# EasyEDA Pro project TeenyV4.eprj, board PCB1
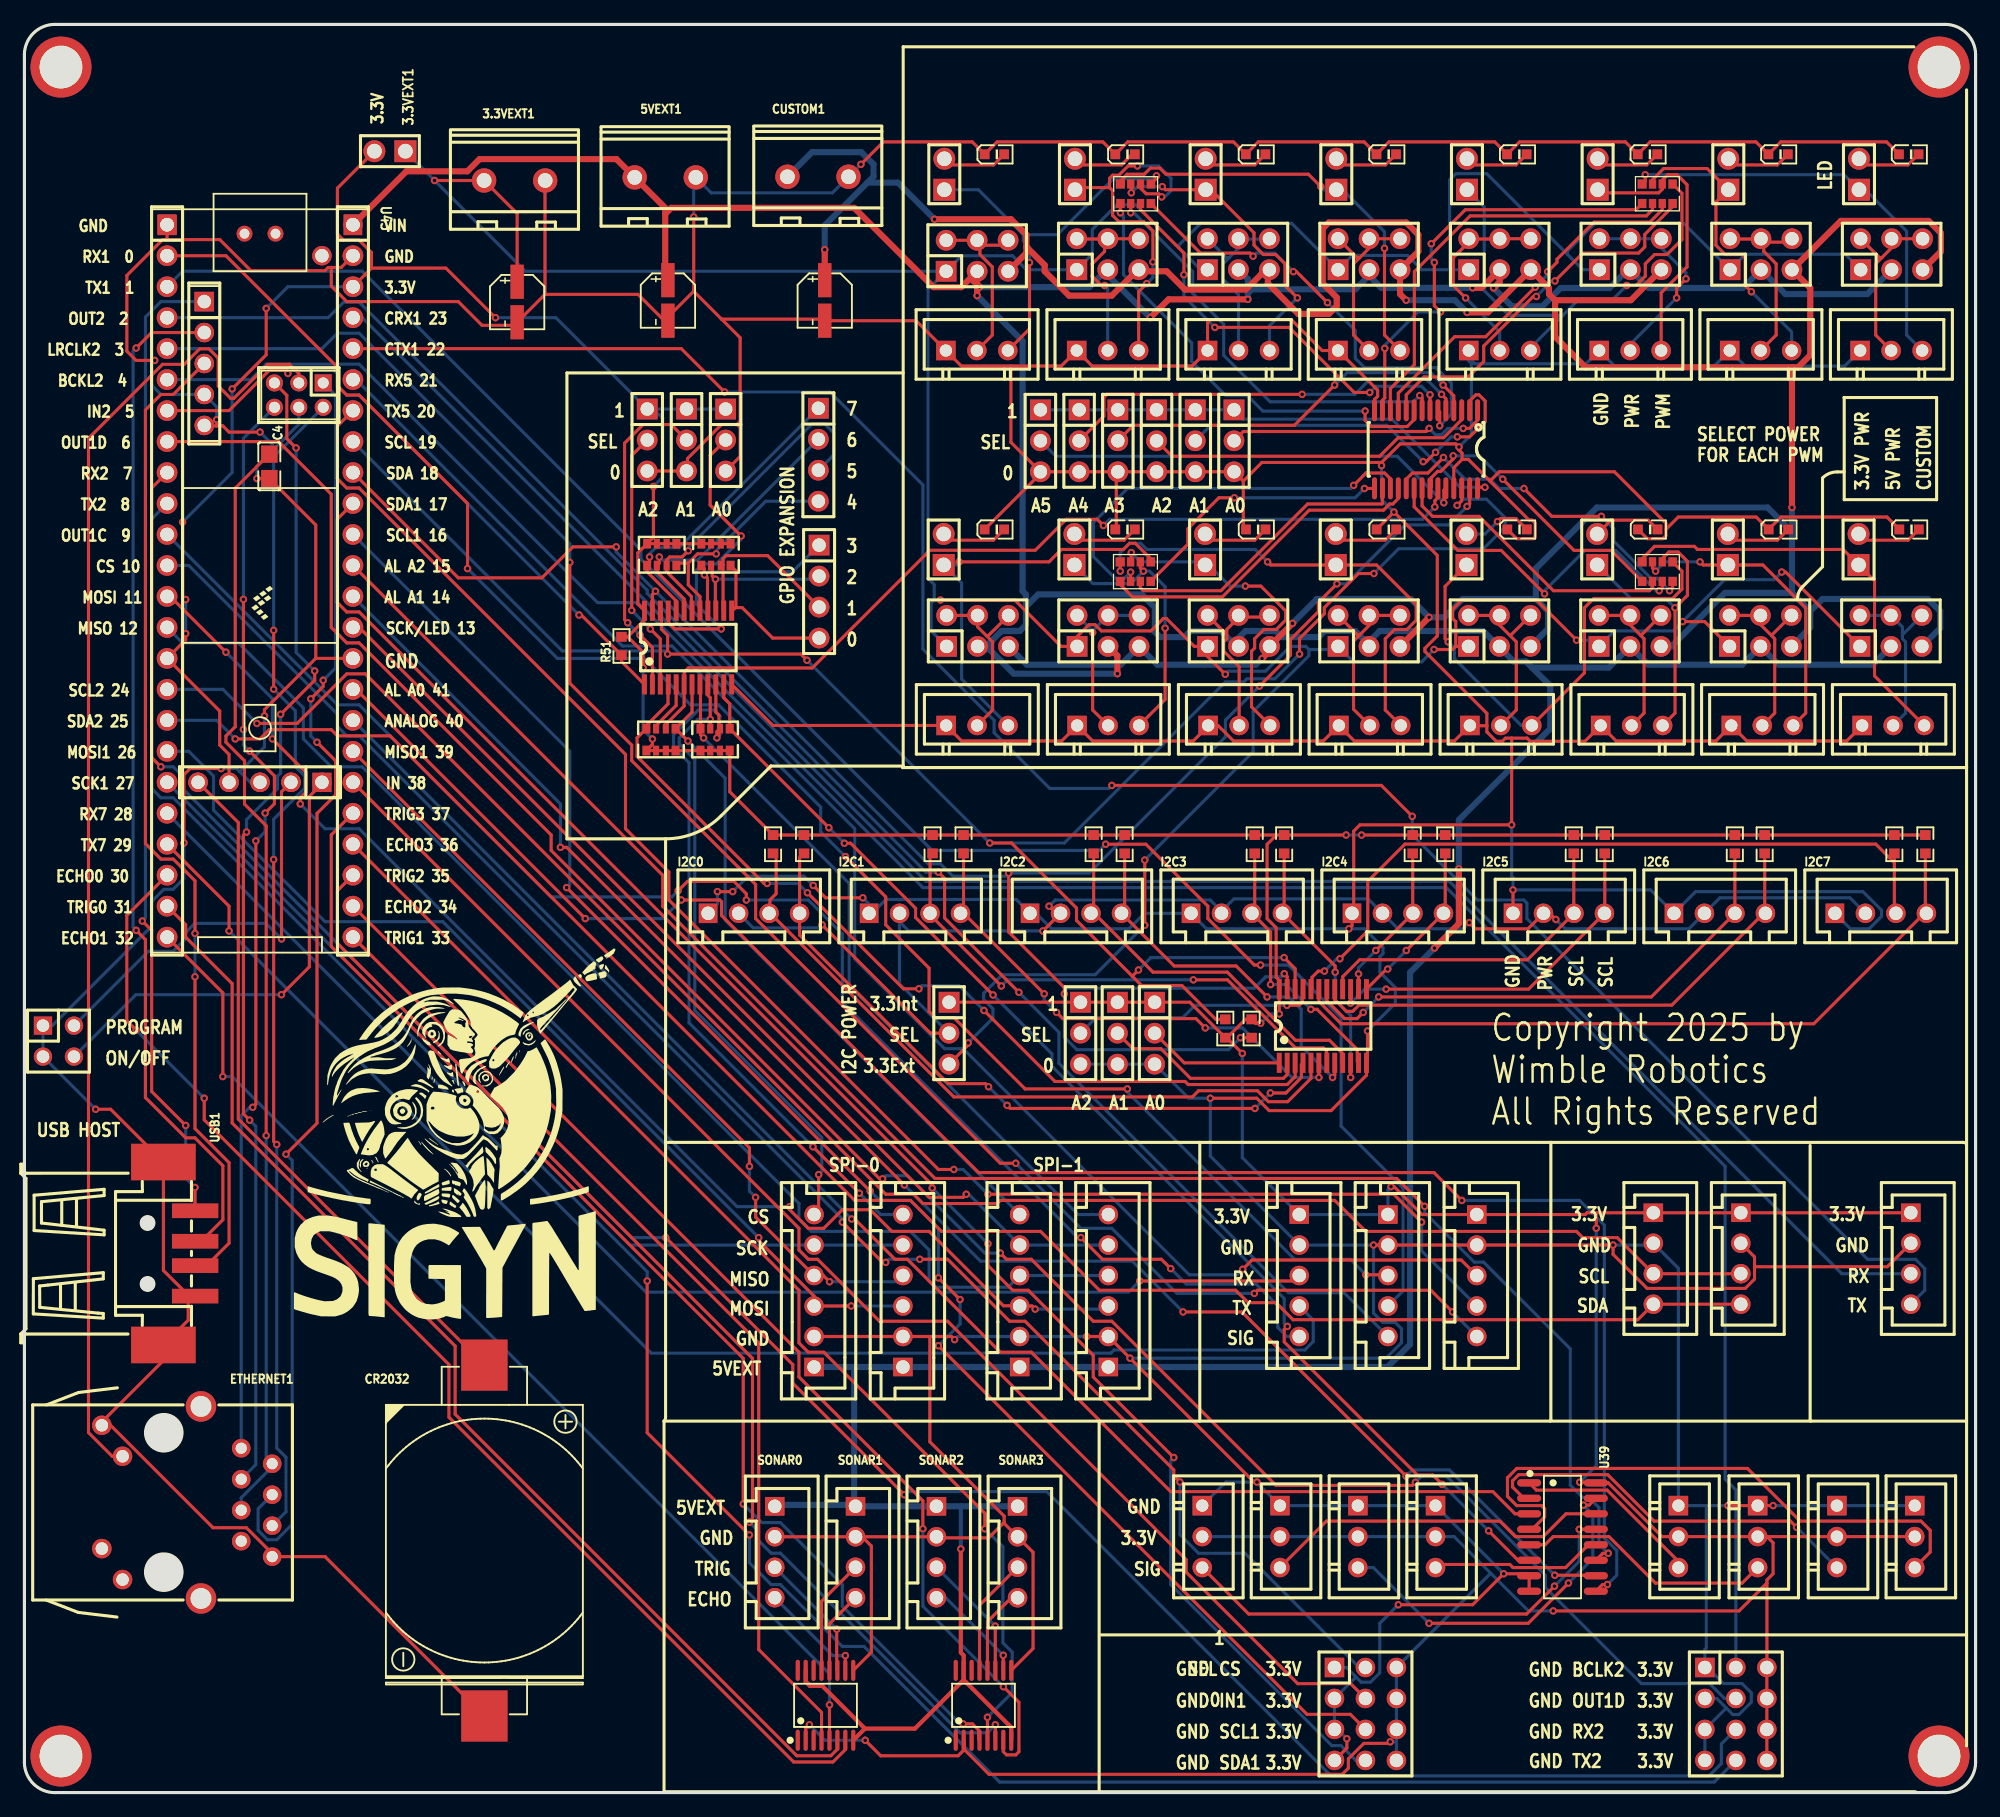
[diagram p7: board, top side]
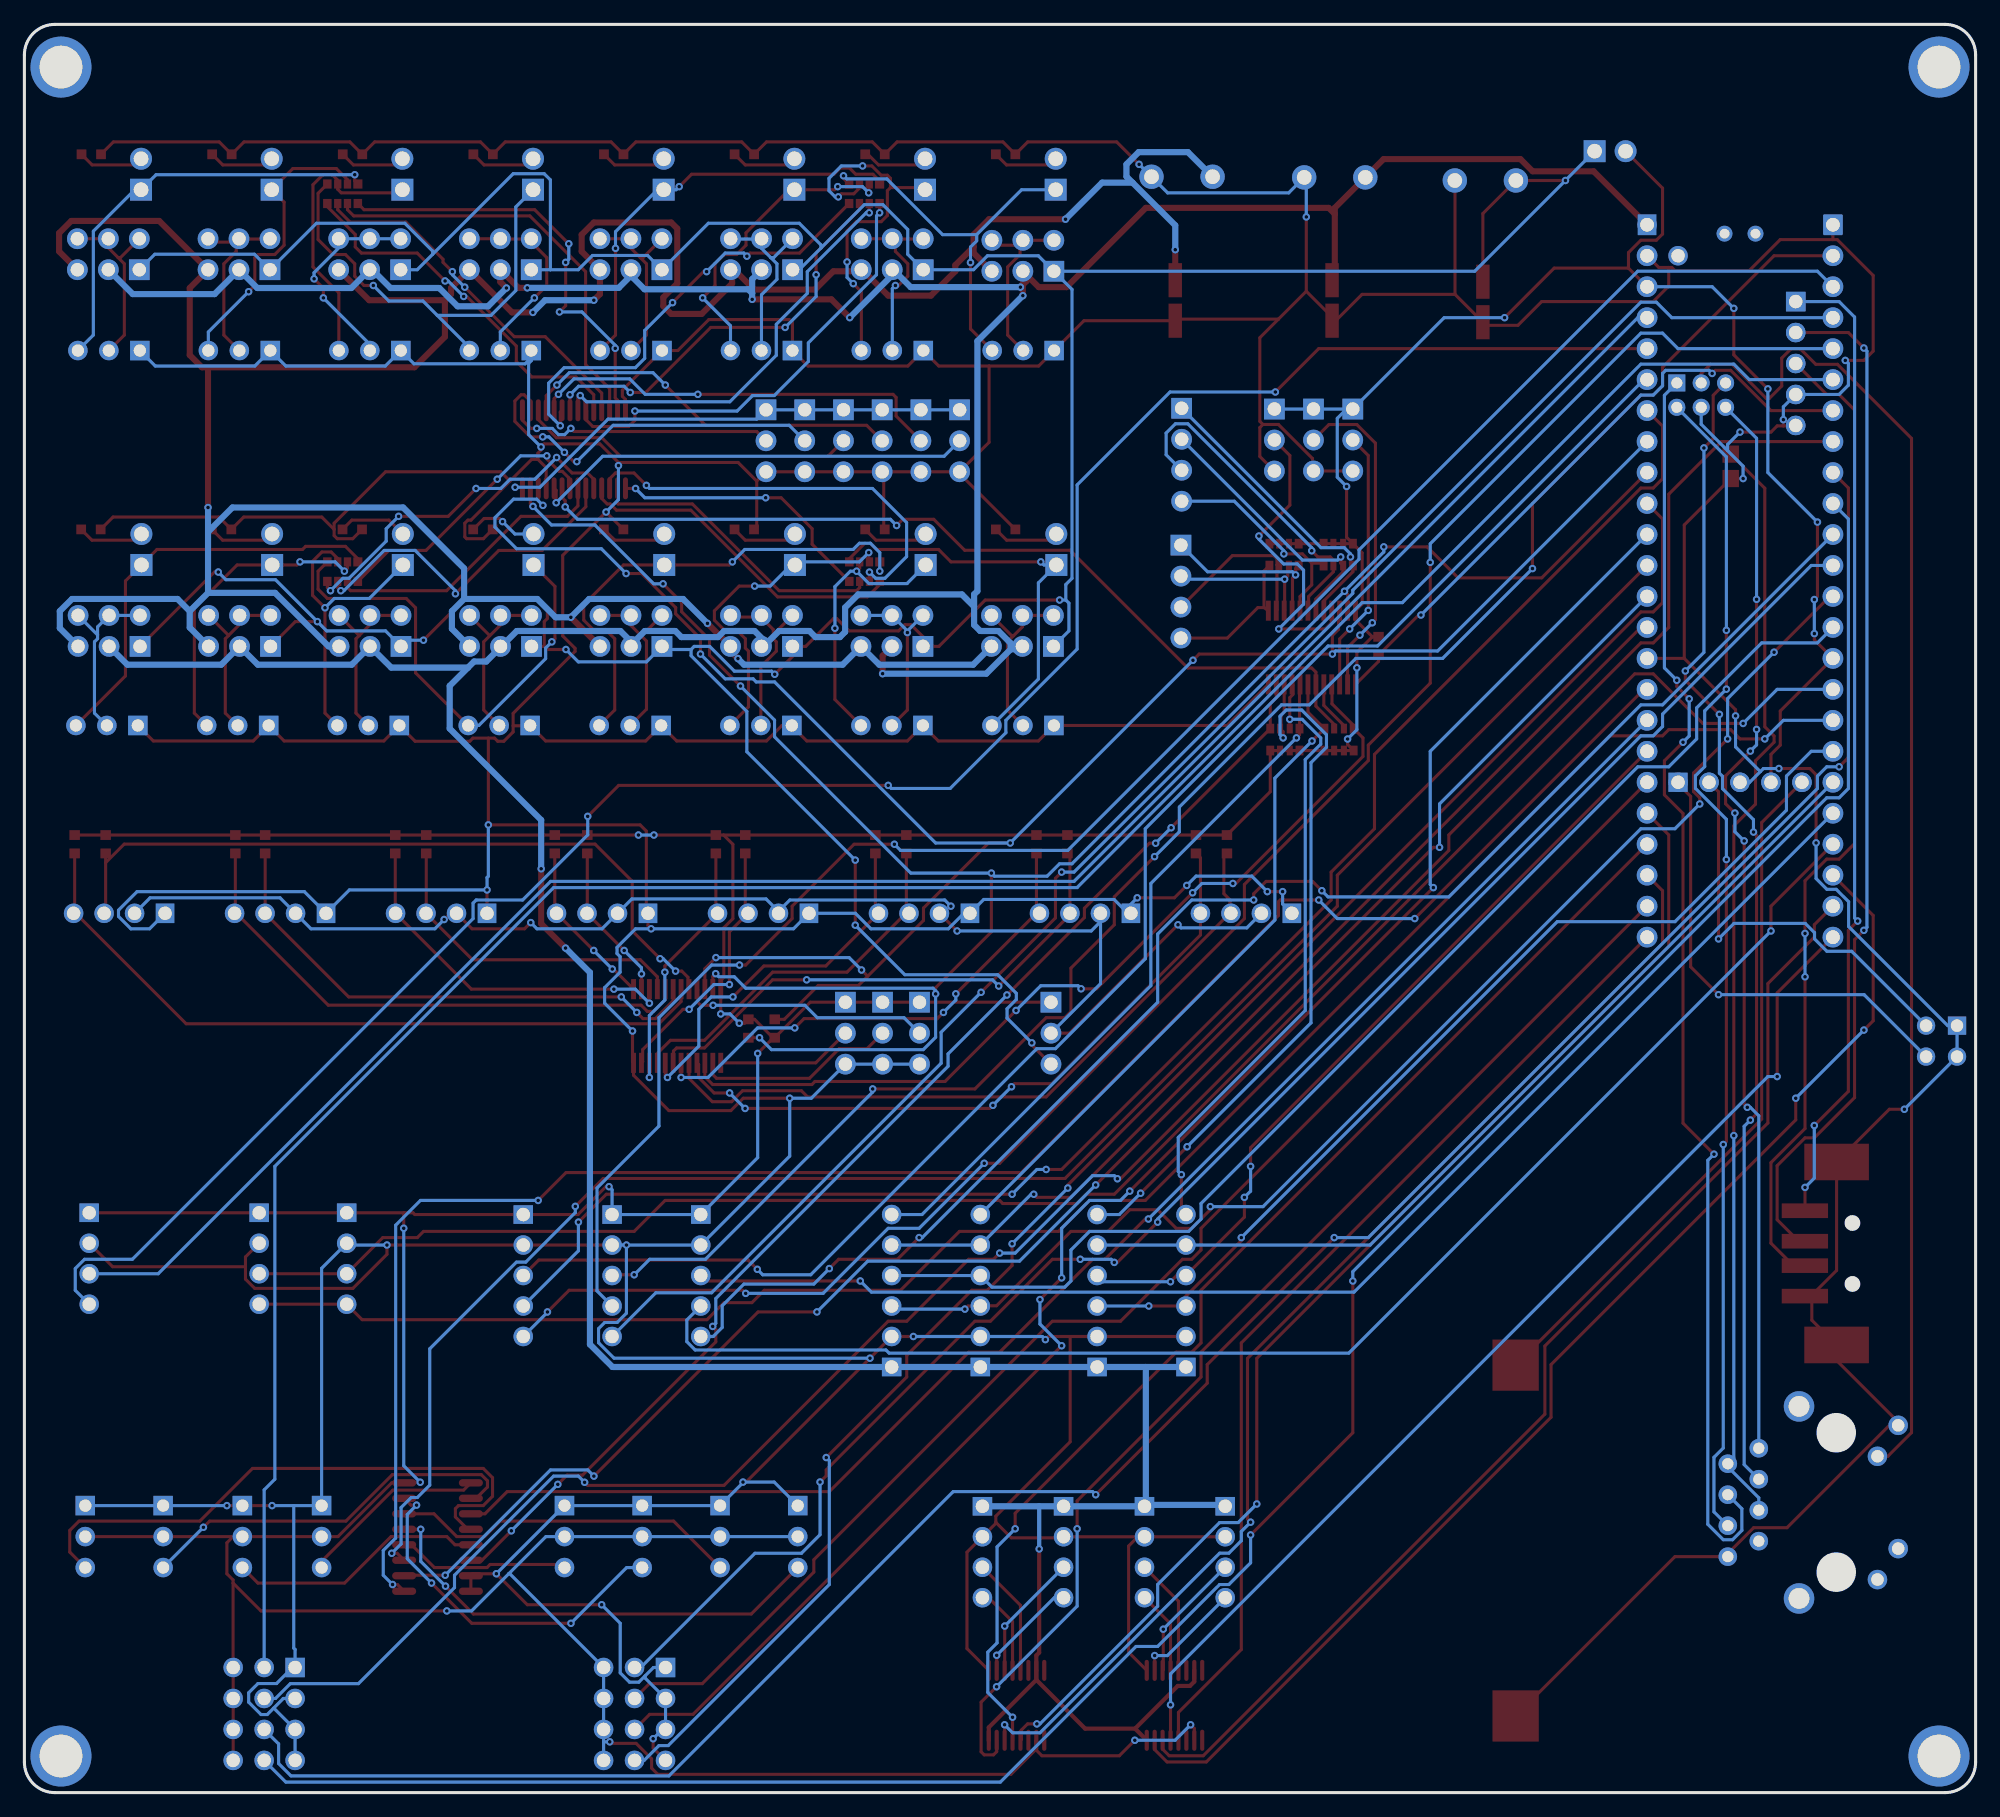
[diagram p8: board, bottom side, seen from below]

Outline 160 x 145 mm; copper layers: Top Layer, Ground, 3r3, Bottom Layer. Coordinates in mm from the lower left corner of the outline.
Outline path: 0,142.5 0,2.5 arc(0.73,0.73) 2.5,0 157.5,0 arc(159.27,0.73) 160,2.5 160,142.5 arc(159.27,144.27) 157.5,145 2.5,145 arc(0.73,144.27) 0,142.5
Stack: Top Layer 0.035mm Outer layer thickness 1oz / Dielectric1 0.2104mm 7628 RC49% 8.6mil / Ground 0.0152mm Inner layer thickness / Dielectric2 1.065mm 1.1mm H/HOZ Copper / 3r3 0.0152mm Inner layer thickness / Dielectric3 0.2104mm 7628 RC49% 8.6mil / Bottom Layer 0.035mm Outer layer thickness 1oz

## Design rules (mm)
net VIN: PowerRail
net CUST: PowerRail
template: Custom Config
spacing copperThickness1oz (default): track to track 0.102, other pairs 0.152 to 0.3
spacing copperThickness2oz: track to track 0.203, other pairs 0.152 to 0.3
track width copperThickness1oz (default): min 0.127, default 0.254, max 2.54
track width copperThickness2oz: min 0.203, default 0.254, max 2.54
track width PowerRail: min 0.254, default 0.5, max 2.54
differential pair differentialPair (default): width min 0.127, default 0.254, max 2.54; gap min 0.152, default 0.152
via viaSize (default): diameter min 0.5, default 0.61, max 10; hole min 0.3, default 0.305, max 6.3
net class PowerRail uses PowerRail
net VIN uses PowerRail
net CUST uses PowerRail

## Placement (name value [footprint] x y rotation side)
3.3VEXT1  WJ127-5.0-2P  [CONN-TH_2P-P5.00_CPC3703CTR]  40.2 132.2 180 top
5VEXT1  WJ127-5.0-2P  [CONN-TH_2P-P5.00_CPC3703CTR]  52.55 132.45 180 top
C1  10uF  [CAP-SMD_BD4.0-L4.3-W4.3-LS5.0-FD]  40.41 122.24 270 top
C2  10uF  [CAP-SMD_BD4.0-L4.3-W4.3-LS5.0-FD]  52.77 122.36 270 top
C3  10uF  [CAP-SMD_BD4.0-L4.3-W4.3-LS5.0-FD]  65.63 122.36 270 top
C4  100nF  [C0805]  20.08 108.76 270 top
CN10  ZX-XH2.54-4PZZ  [CONN-TH_4P-P2.50_4PIN]  154.69 43.8 270 top
CN11  ZX-XH2.54-4PZZ  [CONN-TH_4P-P2.50_4PIN]  133.57 43.8 270 top
CN12  ZX-XH2.54-4PZZ  [CONN-TH_4P-P2.50_4PIN]  140.75 43.8 270 top
CN56  ZX-XH2.54-3PZZ  [CONN-TH_3P-P2.54_2501S-3P]  155.01 21 270 top
CN57  ZX-XH2.54-3PZZ  [CONN-TH_3P-P2.54_2501S-3P]  148.62 21 270 top
CN58  ZX-XH2.54-3PZZ  [CONN-TH_3P-P2.54_2501S-3P]  142.13 21 270 top
CN59  ZX-XH2.54-3PZZ  [CONN-TH_3P-P2.54_2501S-3P]  135.63 21 270 top
CN60  ZX-XH2.54-3PZZ  [CONN-TH_3P-P2.54_2501S-3P]  115.71 21 270 top
CN61  ZX-XH2.54-3PZZ  [CONN-TH_3P-P2.54_2501S-3P]  109.34 21 270 top
CN62  ZX-XH2.54-3PZZ  [CONN-TH_3P-P2.54_2501S-3P]  102.96 21 270 top
CN63  ZX-XH2.54-3PZZ  [CONN-TH_3P-P2.54_2501S-3P]  96.58 21 270 top
CN72  ZX-XH2.54-3PZZ  [CONN-TH_3P-P2.54_2501S-3P]  78.1 118.25 0 top
CN73  ZX-XH2.54-3PZZ  [CONN-TH_3P-P2.54_2501S-3P]  88.83 118.25 0 top
CN74  ZX-XH2.54-3PZZ  [CONN-TH_3P-P2.54_2501S-3P]  99.56 118.25 0 top
CN75  ZX-XH2.54-3PZZ  [CONN-TH_3P-P2.54_2501S-3P]  110.26 118.25 0 top
CN76  ZX-XH2.54-3PZZ  [CONN-TH_3P-P2.54_2501S-3P]  120.97 118.25 0 top
CN77  ZX-XH2.54-3PZZ  [CONN-TH_3P-P2.54_2501S-3P]  131.67 118.25 0 top
CN78  ZX-XH2.54-3PZZ  [CONN-TH_3P-P2.54_2501S-3P]  142.37 118.25 0 top
CN79  ZX-XH2.54-3PZZ  [CONN-TH_3P-P2.54_2501S-3P]  153.07 118.25 0 top
CN80  ZX-XH2.54-3PZZ  [CONN-TH_3P-P2.54_2501S-3P]  78.12 87.51 0 top
CN81  ZX-XH2.54-3PZZ  [CONN-TH_3P-P2.54_2501S-3P]  88.87 87.51 0 top
CN82  ZX-XH2.54-3PZZ  [CONN-TH_3P-P2.54_2501S-3P]  99.61 87.51 0 top
CN83  ZX-XH2.54-3PZZ  [CONN-TH_3P-P2.54_2501S-3P]  110.32 87.51 0 top
CN84  ZX-XH2.54-3PZZ  [CONN-TH_3P-P2.54_2501S-3P]  121.07 87.51 0 top
CN85  ZX-XH2.54-3PZZ  [CONN-TH_3P-P2.54_2501S-3P]  131.8 87.51 0 top
CN86  ZX-XH2.54-3PZZ  [CONN-TH_3P-P2.54_2501S-3P]  142.51 87.51 0 top
CN87  ZX-XH2.54-3PZZ  [CONN-TH_3P-P2.54_2501S-3P]  153.24 87.51 0 top
CR2032  CR2032-BS-6  [BAT-TH_CR2032-BS-6-1]  37.72 20.67 90 top
CUSTOM1  WJ127-5.0-2P  [CONN-TH_2P-P5.00_CPC3703CTR]  65.07 132.51 180 top
ETHERNET1  J1B1211CCD  [RJ45-TH_J1B1211CCD]  13.33 23.79 270 top
F1  220Ω  [RES-ARRAY-SMD_0603-8P-L3.2-W1.6-TL]  91.12 131.11 270 top
F2  220Ω  [RES-ARRAY-SMD_0603-8P-L3.2-W1.6-TL]  133.91 131.11 270 top
F3  220Ω  [RES-ARRAY-SMD_0603-8P-L3.2-W1.6-TL]  91.11 100.12 270 top
F4  220Ω  [RES-ARRAY-SMD_0603-8P-L3.2-W1.6-TL]  133.91 100.12 270 top
GPIO1  PZ254V-11-04P  [HDR-TH_4P-P2.54-V-M]  65.11 109.71 270 top
GPIO2  PZ254V-11-04P  [HDR-TH_4P-P2.54-V-M]  65.16 98.49 270 top
H2  PH-00013  [HDR-TH_2P-P2.54-V-M-R2-C1-S2.54]  86.15 132.71 0 top
H3  PH-00013  [HDR-TH_2P-P2.54-V-M-R2-C1-S2.54]  75.43 132.71 0 top
H4  PH-00013  [HDR-TH_2P-P2.54-V-M-R2-C1-S2.54]  96.86 132.71 0 top
H5  PH-00013  [HDR-TH_2P-P2.54-V-M-R2-C1-S2.54]  107.58 132.71 0 top
H6  PH-00013  [HDR-TH_2P-P2.54-V-M-R2-C1-S2.54]  118.29 132.71 0 top
H7  PH-00013  [HDR-TH_2P-P2.54-V-M-R2-C1-S2.54]  129.01 132.71 0 top
H8  PH-00013  [HDR-TH_2P-P2.54-V-M-R2-C1-S2.54]  139.72 132.71 0 top
H9  PH-00013  [HDR-TH_2P-P2.54-V-M-R2-C1-S2.54]  150.44 132.71 0 top
H10  PH-00013  [HDR-TH_2P-P2.54-V-M-R2-C1-S2.54]  75.38 101.94 0 top
H11  PH-00013  [HDR-TH_2P-P2.54-V-M-R2-C1-S2.54]  86.1 101.94 0 top
H12  PH-00013  [HDR-TH_2P-P2.54-V-M-R2-C1-S2.54]  96.82 101.94 0 top
H13  PH-00013  [HDR-TH_2P-P2.54-V-M-R2-C1-S2.54]  107.53 101.94 0 top
H14  PH-00013  [HDR-TH_2P-P2.54-V-M-R2-C1-S2.54]  118.25 101.94 0 top
H15  PH-00013  [HDR-TH_2P-P2.54-V-M-R2-C1-S2.54]  128.97 101.94 0 top
H16  PH-00013  [HDR-TH_2P-P2.54-V-M-R2-C1-S2.54]  139.69 101.94 0 top
H17  PH-00013  [HDR-TH_2P-P2.54-V-M-R2-C1-S2.54]  150.4 101.94 0 top
H18  HX PZ2.54-2x2P ZZ  [HDR-TH_HX-PZ2.54-2X2P-ZZ]  2.79 61.62 270 top
H19  PH-00013  [HDR-TH_2P-P2.54-V-M-R2-C1-S2.54]  29.97 134.6 90 top
I2C0  ZX-XH2.54-4PZZ  [CONN-TH_4P-P2.50_4PIN]  59.81 72.11 0 top
I2C1  ZX-XH2.54-4PZZ  [CONN-TH_4P-P2.50_4PIN]  73.01 72.11 0 top
I2C1-A0  PZ254V-11-03P  [HDR-TH_3P-P2.54-V-M]  92.68 62.28 270 top
I2C1-A1  PZ254V-11-03P  [HDR-TH_3P-P2.54-V-M]  89.63 62.28 270 top
I2C1-A2  PZ254V-11-03P  [HDR-TH_3P-P2.54-V-M]  86.6 62.28 270 top
I2C1-PWR1  PZ254V-11-03P  [HDR-TH_3P-P2.54-V-M]  75.82 62.28 270 top
I2C2  ZX-XH2.54-4PZZ  [CONN-TH_4P-P2.50_4PIN]  86.21 72.11 0 top
I2C3  ZX-XH2.54-4PZZ  [CONN-TH_4P-P2.50_4PIN]  99.41 72.11 0 top
I2C4  ZX-XH2.54-4PZZ  [CONN-TH_4P-P2.50_4PIN]  112.61 72.11 0 top
I2C5  ZX-XH2.54-4PZZ  [CONN-TH_4P-P2.50_4PIN]  125.81 72.11 0 top
I2C6  ZX-XH2.54-4PZZ  [CONN-TH_4P-P2.50_4PIN]  139.01 72.11 0 top
I2C7  ZX-XH2.54-4PZZ  [CONN-TH_4P-P2.50_4PIN]  152.21 72.11 0 top
I2CX-A0  PZ254V-11-03P  [HDR-TH_3P-P2.54-V-M]  57.5 110.92 270 top
I2CX-A1  PZ254V-11-03P  [HDR-TH_3P-P2.54-V-M]  54.3 110.92 270 top
I2CX-A2  PZ254V-11-03P  [HDR-TH_3P-P2.54-V-M]  51.07 110.92 270 top
LED1  19-219/GHC-YR2T1B5Y/3T  [LED-SMD_L1.6-W0.8_19-219-GHC-YR2T1B5Y-3T]  90.25 134.35 0 top
LED2  19-219/GHC-YR2T1B5Y/3T  [LED-SMD_L1.6-W0.8_19-219-GHC-YR2T1B5Y-3T]  79.54 134.35 0 top
LED3  19-219/GHC-YR2T1B5Y/3T  [LED-SMD_L1.6-W0.8_19-219-GHC-YR2T1B5Y-3T]  100.96 134.35 0 top
LED4  19-219/GHC-YR2T1B5Y/3T  [LED-SMD_L1.6-W0.8_19-219-GHC-YR2T1B5Y-3T]  111.67 134.35 0 top
LED5  19-219/GHC-YR2T1B5Y/3T  [LED-SMD_L1.6-W0.8_19-219-GHC-YR2T1B5Y-3T]  122.38 134.35 0 top
LED6  19-219/GHC-YR2T1B5Y/3T  [LED-SMD_L1.6-W0.8_19-219-GHC-YR2T1B5Y-3T]  133.09 134.35 0 top
LED7  19-219/GHC-YR2T1B5Y/3T  [LED-SMD_L1.6-W0.8_19-219-GHC-YR2T1B5Y-3T]  143.81 134.35 0 top
LED8  19-219/GHC-YR2T1B5Y/3T  [LED-SMD_L1.6-W0.8_19-219-GHC-YR2T1B5Y-3T]  154.52 134.35 0 top
LED9  19-219/GHC-YR2T1B5Y/3T  [LED-SMD_L1.6-W0.8_19-219-GHC-YR2T1B5Y-3T]  79.54 103.59 0 top
LED10  19-219/GHC-YR2T1B5Y/3T  [LED-SMD_L1.6-W0.8_19-219-GHC-YR2T1B5Y-3T]  90.25 103.59 0 top
LED11  19-219/GHC-YR2T1B5Y/3T  [LED-SMD_L1.6-W0.8_19-219-GHC-YR2T1B5Y-3T]  100.97 103.59 0 top
LED12  19-219/GHC-YR2T1B5Y/3T  [LED-SMD_L1.6-W0.8_19-219-GHC-YR2T1B5Y-3T]  111.68 103.59 0 top
LED13  19-219/GHC-YR2T1B5Y/3T  [LED-SMD_L1.6-W0.8_19-219-GHC-YR2T1B5Y-3T]  122.4 103.59 0 top
LED14  19-219/GHC-YR2T1B5Y/3T  [LED-SMD_L1.6-W0.8_19-219-GHC-YR2T1B5Y-3T]  133.11 103.59 0 top
LED15  19-219/GHC-YR2T1B5Y/3T  [LED-SMD_L1.6-W0.8_19-219-GHC-YR2T1B5Y-3T]  143.83 103.59 0 top
LED16  19-219/GHC-YR2T1B5Y/3T  [LED-SMD_L1.6-W0.8_19-219-GHC-YR2T1B5Y-3T]  154.54 103.59 0 top
NOREF  -  [Pad_e78618]  157 141.5 0 top
NOREF#2  -  [Pad_e78620]  3 3 0 top
NOREF#3  -  [Pad_e78619]  157 3 0 top
NOREF#4  -  [Pad_e4448]  3 141.5 0 top
PWM-A0  PZ254V-11-03P  [HDR-TH_3P-P2.54-V-M]  99.19 110.85 270 top
PWM-A1  PZ254V-11-03P  [HDR-TH_3P-P2.54-V-M]  96.01 110.85 270 top
PWM-A2  PZ254V-11-03P  [HDR-TH_3P-P2.54-V-M]  92.84 110.85 270 top
PWM-A3  PZ254V-11-03P  [HDR-TH_3P-P2.54-V-M]  89.66 110.85 270 top
PWM-A4  PZ254V-11-03P  [HDR-TH_3P-P2.54-V-M]  86.49 110.85 270 top
PWM-A5  PZ254V-11-03P  [HDR-TH_3P-P2.54-V-M]  83.31 110.85 270 top
R1  3kΩ  [R0603]  63.93 77.77 270 top
R2  3kΩ  [R0603]  61.39 77.77 270 top
R3  3kΩ  [R0603]  77.01 77.77 270 top
R4  3kΩ  [R0603]  74.47 77.77 270 top
R5  3kΩ  [R0603]  90.22 77.77 270 top
R6  3kΩ  [R0603]  87.68 77.77 270 top
R7  3kΩ  [R0603]  103.3 77.77 270 top
R8  3kΩ  [R0603]  100.89 77.77 270 top
R9  3kΩ  [R0603]  153.34 77.77 90 top
R10  3kΩ  [R0603]  155.88 77.77 90 top
R11  3kΩ  [R0603]  140.26 77.77 90 top
R12  3kΩ  [R0603]  142.7 77.77 90 top
R13  3kΩ  [R0603]  127.05 77.77 90 top
R14  3kΩ  [R0603]  129.59 77.77 90 top
R15  3kΩ  [R0603]  113.84 77.77 90 top
R16  3kΩ  [R0603]  116.51 77.77 90 top
R17  3kΩ  [R0603]  98.47 62.66 270 top
R18  3kΩ  [R0603]  100.63 62.66 90 top
R51  3kΩ  [R0603]  48.96 94.03 90 top
RN1  10kΩ  [RES-ARRAY-SMD_0603-8P-L3.2-W1.6-BL]  52.2 86.35 0 top
RN2  10kΩ  [RES-ARRAY-SMD_0603-8P-L3.2-W1.6-BL]  56.64 86.35 0 top
RN3  10kΩ  [RES-ARRAY-SMD_0603-8P-L3.2-W1.6-BL]  56.71 101.52 180 top
RN4  10kΩ  [RES-ARRAY-SMD_0603-8P-L3.2-W1.6-BL]  52.26 101.52 180 top
SONAR0  ZX-XH2.54-4PZZ  [CONN-TH_4P-P2.50_4PIN]  61.53 19.73 270 top
SONAR1  ZX-XH2.54-4PZZ  [CONN-TH_4P-P2.50_4PIN]  68.15 19.73 270 top
SONAR2  ZX-XH2.54-4PZZ  [CONN-TH_4P-P2.50_4PIN]  74.79 19.73 270 top
SONAR3  ZX-XH2.54-4PZZ  [CONN-TH_4P-P2.50_4PIN]  81.44 19.73 270 top
U1  Teensy4.1  [Teensy41KiCad]  19.32 99.36 270 top
U2  TCA9548APWR  [TSSOP-24_L7.8-W4.4-P0.65-LS6.4-BL]  106.47 62.86 0 top
U4  ZX-XH2.54-6PZZ  [CONN-TH_6P-P2.50_ZX-XH2.54-6PZZ]  88.88 41.15 270 top
U5  ZX-XH2.54-5PZZ  [CONN-TH_5P-P2.50_ZX-XH2.54-5PZZ]  104.54 42.4 270 top
U6  ZX-XH2.54-5PZZ  [CONN-TH_5P-P2.50_ZX-XH2.54-5PZZ]  111.81 42.4 270 top
U8  ZX-XH2.54-6PZZ  [CONN-TH_6P-P2.50_ZX-XH2.54-6PZZ]  81.61 41.15 270 top
U17  TCA9535PWR  [TSSOP-24_L7.8-W4.4-P0.65-LS6.4-BL]  54.42 93.9 0 top
U18  PCA9685PW,118  [TSSOP-28_L9.7-W4.4-P0.65-LS6.4-TL]  114.94 110.16 270 top
U19  BX-PZ2.54-2-3PZZ  [HDR-TH_6P-P2.54-V-M-R2-C3-S2.54]  78.12 126.03 0 top
U20  BX-PZ2.54-2-3PZZ  [HDR-TH_6P-P2.54-V-M-R2-C3-S2.54]  88.84 126.15 0 top
U21  BX-PZ2.54-2-3PZZ  [HDR-TH_6P-P2.54-V-M-R2-C3-S2.54]  99.55 126.15 0 top
U22  BX-PZ2.54-2-3PZZ  [HDR-TH_6P-P2.54-V-M-R2-C3-S2.54]  110.26 126.15 0 top
U23  BX-PZ2.54-2-3PZZ  [HDR-TH_6P-P2.54-V-M-R2-C3-S2.54]  120.98 126.15 0 top
U24  BX-PZ2.54-2-3PZZ  [HDR-TH_6P-P2.54-V-M-R2-C3-S2.54]  131.69 126.15 0 top
U25  BX-PZ2.54-2-3PZZ  [HDR-TH_6P-P2.54-V-M-R2-C3-S2.54]  142.4 126.15 0 top
U26  BX-PZ2.54-2-3PZZ  [HDR-TH_6P-P2.54-V-M-R2-C3-S2.54]  153.11 126.15 0 top
U27  BX-PZ2.54-2-3PZZ  [HDR-TH_6P-P2.54-V-M-R2-C3-S2.54]  78.16 95.26 0 top
U28  BX-PZ2.54-2-3PZZ  [HDR-TH_6P-P2.54-V-M-R2-C3-S2.54]  88.86 95.26 0 top
U29  BX-PZ2.54-2-3PZZ  [HDR-TH_6P-P2.54-V-M-R2-C3-S2.54]  99.56 95.26 0 top
U30  BX-PZ2.54-2-3PZZ  [HDR-TH_6P-P2.54-V-M-R2-C3-S2.54]  110.26 95.26 0 top
U31  BX-PZ2.54-2-3PZZ  [HDR-TH_6P-P2.54-V-M-R2-C3-S2.54]  120.96 95.26 0 top
U32  BX-PZ2.54-2-3PZZ  [HDR-TH_6P-P2.54-V-M-R2-C3-S2.54]  131.66 95.26 0 top
U33  BX-PZ2.54-2-3PZZ  [HDR-TH_6P-P2.54-V-M-R2-C3-S2.54]  142.36 95.26 0 top
U34  BX-PZ2.54-2-3PZZ  [HDR-TH_6P-P2.54-V-M-R2-C3-S2.54]  153.06 95.26 0 top
U35  TXB0106PWR  [TSSOP-16_L5.0-W4.4-P0.65-LS6.4-BL]  65.69 7.16 0 top
U36  TXB0106PWR  [TSSOP-16_L5.0-W4.4-P0.65-LS6.4-BL]  78.65 7.16 0 top
U39  CD74HC4051M96  [SOIC-16_L9.9-W3.9-P1.27-LS6.0-BL]  126.12 20.96 270 top
U40  ZX-XH2.54-6PZZ  [CONN-TH_6P-P2.50_ZX-XH2.54-6PZZ]  72.04 41.15 270 top
U41  ZX-XH2.54-6PZZ  [CONN-TH_6P-P2.50_ZX-XH2.54-6PZZ]  64.75 41.15 270 top
U42  ZX-XH2.54-5PZZ  [CONN-TH_5P-P2.50_ZX-XH2.54-5PZZ]  119.09 42.4 270 top
U43  HC-PM254-8.5H-1x24PZ  [HDR-TH_24P-P2.54-V-F]  26.94 99.36 270 top
U44  HC-PM254-8.5H-1x24PZ  [HDR-TH_24P-P2.54-V-F]  11.7 99.36 270 top
U46  PM2.54-1*5  [HDR-TH_5P-P2.54-V-F]  14.75 117.19 270 top
U47  2.0-2*3P母  [HDR-TH_6P-P2.00-V-F-R2-C3-S2.00]  22.5 114.6 180 top
U48  PM2.54-1*5  [HDR-TH_5P-P2.54-V-F]  19.32 82.85 180 top
U49  HX PZ2.54-3x4P ZZ  [HDR-TH_12P-P2.54-V-M-R3-C4-S2.54]  140.34 6.45 270 top
U50  HX PZ2.54-3x4P ZZ  [HDR-TH_12P-P2.54-V-M-R3-C4-S2.54]  109.97 6.45 270 top
USB1  904-131A2032S10100  [USB-A-SMD_FUS270-FSBW5K]  12.7 44.21 270 top

## Footprints (pads in the part's own frame, mm; a bottom-side part is the same pattern mirrored in y, then rotated)
BAT-TH_CR2032-BS-6-1
  rect 4.2x3.8 smd: 1(14.385,0) 2(-14.385,0)
C0805
  rect 1.41x1.35 smd: 1(-1,0) 2(1,0)
CAP-SMD_BD4.0-L4.3-W4.3-LS5.0-FD
  rect 2.8x1.1 smd: 1(-1.661,0) 2(1.661,0)
CONN-TH_2P-P5.00_CPC3703CTR
  round 2 hole 1.2: 1(-2.505,0) 2(2.505,0)
CONN-TH_3P-P2.54_2501S-3P
  rect 1.6x1.6 hole 1: 1(-2.54,0)
  round 1.6 hole 1: 2(0,0) 3(2.54,0)
CONN-TH_4P-P2.50_4PIN
  rect 1.524x1.6 hole 1.1: 1(-3.75,0)
  round 1.6 hole 1.1: 2(-1.25,0) 3(1.25,0) 4(3.75,0)
CONN-TH_5P-P2.50_ZX-XH2.54-5PZZ
  rect 1.524x1.6 hole 1.1: 1(-5,0)
  round 1.6 hole 1.1: 2(-2.5,0) 3(0,0) 4(2.5,0) 5(5,0)
CONN-TH_6P-P2.50_ZX-XH2.54-6PZZ
  rect 1.524x1.6 hole 1.1: 1(6.25,0)
  round 1.6 hole 1.1: 2(3.75,0) 3(1.25,0) 4(-1.25,0) 5(-3.75,0) 6(-6.25,0)
HDR-TH_2P-P2.54-V-M-R2-C1-S2.54
  rect 1.8x1.8 hole 1.2: 1(0,-1.27)
  round 1.8 hole 1.2: 2(0,1.27)
HDR-TH_3P-P2.54-V-M
  rect 1.7x1.7 hole 1.1: 1(-2.54,0)
  round 1.7 hole 1.1: 2(0,0) 3(2.54,0)
HDR-TH_4P-P2.54-V-M
  rect 1.7x1.7 hole 1.1: 1(-3.81,0)
  round 1.7 hole 1.1: 2(-1.27,0) 3(1.27,0) 4(3.81,0)
HDR-TH_5P-P2.54-V-F
  rect 1.575x1.575 hole 1.02: 1(-5.08,0)
  round 1.575 hole 1.02: 2(-2.54,0) 3(0,0) 4(2.54,0) 5(5.08,0)
HDR-TH_6P-P2.00-V-F-R2-C3-S2.00
  rect 1.4x1.4 hole 0.9: 1(-2,-1)
  round 1.4 hole 0.9: 2(-2,1) 3(0,-1) 4(0,1) 5(2,-1) 6(2,1)
HDR-TH_6P-P2.54-V-M-R2-C3-S2.54
  rect 1.7x1.7 hole 1.1: 1(-2.54,-1.27)
  round 1.7 hole 1.1: 2(-2.54,1.27) 3(0,-1.27) 4(0,1.27) 5(2.54,-1.27) 6(2.54,1.27)
HDR-TH_12P-P2.54-V-M-R3-C4-S2.54
  rect 1.6x1.6 hole 1.1: 1(-3.81,-2.54)
  round 1.6 hole 1.1: 2(-3.81,0) 3(-3.81,2.54) 4(-1.27,-2.54) 5(-1.27,0) 6(-1.27,2.54) 7(1.27,-2.54) 8(1.27,0) 9(1.27,2.54) 10(3.81,-2.54) 11(3.81,0) 12(3.81,2.54)
HDR-TH_24P-P2.54-V-F
  rect 1.7x1.524 hole 1.1: 1(-29.21,0)
  round 1.7 hole 1.1: 2(-26.67,0) 3(-24.13,0) 4(-21.59,0) 5(-19.05,0) 6(-16.51,0) 7(-13.97,0) 8(-11.43,0) 9(-8.89,0) 10(-6.35,0) 11(-3.81,0) 12(-1.27,0) 13(1.27,0) 14(3.81,0) 15(6.35,0) 16(8.89,0) 17(11.43,0) 18(13.97,0) 19(16.51,0) 20(19.05,0) 21(21.59,0) 22(24.13,0) 23(26.67,0) 24(29.21,0)
HDR-TH_HX-PZ2.54-2X2P-ZZ
  rect 1.5x1.5 hole 1.02: 1(-1.27,-1.27)
  round 1.5 hole 1.02: 2(-1.27,1.27) 3(1.27,-1.27) 4(1.27,1.27)
LED-SMD_L1.6-W0.8_19-219-GHC-YR2T1B5Y-3T
  rect 0.8x0.8 smd: 1(0.799,0) 2(-0.799,0)
Pad_e4448
  round 5 hole 3.5: 1(0,0)
Pad_e78618
  round 5 hole 3.5: 1(0,0)
Pad_e78619
  round 5 hole 3.5: 1(0,0)
Pad_e78620
  round 5 hole 3.5: 1(0,0)
R0603
  rect 0.806x0.864 smd: 1(-0.753,0) 2(0.753,0)
RES-ARRAY-SMD_0603-8P-L3.2-W1.6-BL
  rect 0.65x0.8 smd: 1(-1.2,-0.9) 4(1.2,-0.9) 5(1.2,0.9) 8(-1.2,0.9)
  rect 0.5x0.8 smd: 2(-0.4,-0.9) 3(0.4,-0.9) 6(0.4,0.9) 7(-0.4,0.9)
RES-ARRAY-SMD_0603-8P-L3.2-W1.6-TL
  rect 0.75x0.7 smd: 1(-0.8,1.25) 5(0.8,-1.25) 8(0.8,1.25)
  rect 0.75x0.6 smd: 2(-0.8,0.4) 3(-0.8,-0.4) 6(0.8,-0.4) 7(0.8,0.4)
  rect 0.75x0.75 smd: 4(-0.8,-1.25)
RJ45-TH_J1B1211CCD
  round 1.524 hole 0.914: 1(-4.445,4.445) 2(-3.175,6.985) 3(-1.905,4.445) 4(-0.635,6.985) 5(0.635,4.445) 6(1.905,6.985) 7(3.175,4.445) 8(4.445,6.985)
  round 1.6 hole 1.02: 9(-6.325,-6.985) 10(-3.785,-5.285) 11(3.785,-6.985) 12(6.325,-5.285)
  round 2.5 hole 1.7: 13(-7.875,1.145) 14(7.875,1.145)
SOIC-16_L9.9-W3.9-P1.27-LS6.0-BL
  oval 0.602x1.971 smd: 1(-4.445,-2.736) 2(-3.175,-2.736) 3(-1.905,-2.736) 4(-0.635,-2.736) 5(0.635,-2.736) 6(1.905,-2.736) 7(3.175,-2.736) 8(4.445,-2.736) 9(4.445,2.736) 10(3.175,2.736) 11(1.905,2.736) 12(0.635,2.736) 13(-0.635,2.736) 14(-1.905,2.736) 15(-3.175,2.736) 16(-4.445,2.736)
Teensy41KiCad
  rect 1.6x1.6 hole 1.1: 1(-29.21,-7.62) 55(-22.911,-4.569)
  round 1.6 hole 1.1: 2(-26.67,-7.62) 3(-24.13,-7.62) 4(-21.59,-7.62) 5(-19.05,-7.62) 6(-16.51,-7.62) 7(-13.97,-7.62) 8(-11.43,-7.62) 9(-8.89,-7.62) 10(-6.35,-7.62) 11(-3.81,-7.62) 12(-1.27,-7.62) 13(1.27,-7.62) 14(3.81,-7.62) 15(6.35,-7.62) 16(8.89,-7.62) 17(11.43,-7.62) 18(13.97,-7.62) 19(16.51,-7.62) 20(19.05,-7.62) 21(21.59,-7.62) 22(24.13,-7.62) 23(26.67,-7.62) 24(29.21,-7.62) 25(29.21,7.62) 26(26.67,7.62) 27(24.13,7.62) 28(21.59,7.62) 29(19.05,7.62) 30(16.51,7.62) 31(13.97,7.62) 32(11.43,7.62) 33(8.89,7.62) 34(6.35,7.62) 35(3.81,7.62) 36(1.27,7.62) 37(-1.27,7.62) 38(-3.81,7.62) 39(-6.35,7.62) 40(-8.89,7.62) 41(-11.43,7.62) 42(-13.97,7.62) 43(-16.51,7.62) 44(-19.05,7.62) 45(-21.59,7.62) 46(-24.13,7.62) 47(-26.67,7.62) 48(-29.21,7.62) 49(-26.67,5.08) 50(16.51,-5.08) 51(16.51,-2.54) 52(16.51,0) 53(16.51,2.54) 54(16.51,5.08) 56(-20.371,-4.569) 57(-17.831,-4.569) 58(-15.291,-4.569) 59(-12.751,-4.569)
  rect 1.3x1.3 hole 0.8: 60(-16.24,5.181)
  round 1.3 hole 0.8: 61(-16.24,3.182) 62(-16.24,1.181) 63(-14.24,1.181) 64(-14.24,3.182) 65(-14.24,5.181) 66(-28.48,1.27) 67(-28.48,-1.27)
TSSOP-16_L5.0-W4.4-P0.65-LS6.4-BL
  oval 0.343x1.732 smd: 1(-2.275,-2.866) 2(-1.625,-2.866) 3(-0.975,-2.866) 4(-0.325,-2.866) 5(0.325,-2.866) 6(0.975,-2.866) 7(1.625,-2.866) 8(2.275,-2.866) 9(2.275,2.866) 10(1.625,2.866) 11(0.975,2.866) 12(0.325,2.866) 13(-0.325,2.866) 14(-0.975,2.866) 15(-1.625,2.866) 16(-2.275,2.866)
TSSOP-24_L7.8-W4.4-P0.65-LS6.4-BL
  rect 0.4x1.65 smd: 1(-3.575,-3.022) 2(-2.925,-3.022) 3(-2.275,-3.022) 4(-1.625,-3.022) 5(-0.975,-3.022) 6(-0.325,-3.022) 7(0.325,-3.022) 8(0.975,-3.022) 9(1.625,-3.022) 10(2.275,-3.022) 11(2.925,-3.022) 12(3.575,-3.022) 13(3.575,3.022) 14(2.925,3.022) 15(2.275,3.022) 16(1.625,3.022) 17(0.975,3.022) 18(0.325,3.022) 19(-0.325,3.022) 20(-0.975,3.022) 21(-1.625,3.022) 22(-2.275,3.022) 23(-2.925,3.022) 24(-3.575,3.022)
TSSOP-28_L9.7-W4.4-P0.65-LS6.4-TL
  oval 1.804x0.406 smd: 1(-3.2,4.225) 2(-3.2,3.575) 3(-3.2,2.925) 4(-3.2,2.275) 5(-3.2,1.625) 6(-3.2,0.975) 7(-3.2,0.325) 8(-3.2,-0.325) 9(-3.2,-0.975) 10(-3.2,-1.625) 11(-3.2,-2.275) 12(-3.2,-2.925) 13(-3.2,-3.575) 14(-3.2,-4.225) 15(3.2,-4.225) 16(3.2,-3.575) 17(3.2,-2.925) 18(3.2,-2.275) 19(3.2,-1.625) 20(3.2,-0.975) 21(3.2,-0.325) 22(3.2,0.325) 23(3.2,0.975) 24(3.2,1.625) 25(3.2,2.275) 26(3.2,2.925) 27(3.2,3.575) 28(3.2,4.225)
USB-A-SMD_FUS270-FSBW5K
  rect 1.2x3.8 smd: 1(-3.505,1.3) 2(-1.005,1.3) 3(0.997,1.3) 4(3.496,1.3)
  rect 3x5.3 smd: 5(-7.5,-1.3) 5(7.5,-1.3)

## Nets
As in the schematic.

Pads without a net: ETHERNET1 7 11 12 13 14; NOREF 1; NOREF#2 1; NOREF#3 1; NOREF#4 1; U1 49 66 67; U35 1 3 14 16; U36 1 3 14 16

## Via types
v1: diameter 0.61, hole 0.305, Top Layer to Bottom Layer, 359 vias

## Routing (per net, layer and track width the routed paths; a pad name or vN(x,y) marks a point on that pad's centre or on a via; arc(x,y) is an arc through that point)
3.3V: length 39.7
  Top Layer w0.254: U18.28 119.25,107.04 v1(119.76,107.04)
  Bottom Layer w0.254: PWM-A5.1 PWM-A4.1 PWM-A3.1 PWM-A2.1 PWM-A1.1 PWM-A0.1 99.95,112.63 112.14,112.63 117.73,107.04 v1(119.76,107.04)
3.3VEXT: length 351.8
  Top Layer w0.254: v1(127.28,94.5) 123.97,97.8 117.88,97.8 117.12,97.04 117.12,96.28 117.37,96.03 117.37,93.99 ; 117.37,93.99 117.12,93.74 v1(115.59,93.74) ; 117.37,93.99 U31.1 ; U34.1 144.42,100.09 v1(144.1,100.09) ; 96.95,93.99 96.95,93.23 v1(98.47,91.71) ; 96.95,93.99 95.93,93.99 93.65,96.28 93.39,96.28 92.38,95.26 88.31,95.26 87.81,95.77 87.3,95.77 86.28,94.76 86.28,93.99 ; 96.95,93.99 U29.1 ; 86.28,93.99 85.01,93.99 81.21,97.8 v1(75.11,97.8) ; 86.28,93.99 U28.1 ; C1.1 40.41,129.49 3.3VEXT1.2 v1(33.63,132.2) ; I2C1-PWR1.3 77.39,61.31 v1(77.39,61.48) ; v1(135.97,96.03) 137.78,96.03 U33.1 ; v1(91.87,76.47) v1(91.87,71.13)
  Bottom Layer w0.254: 74.6,97.8 74.6,99.07 74.1,99.57 74.1,123.27 U19.1 ; 74.6,97.8 v1(75.11,97.8) ; 74.6,97.8 74.35,97.54 74.35,95.26 U27.1 ; U24.1 127.79,124.88 126.52,126.15 ; v1(98.47,91.71) 98.73,91.96 101.78,91.96 103.81,93.99 105.08,93.99 105.33,93.74 ; U19.1 76.85,126.03 81.03,126.03 82.17,124.88 U20.1 87.57,126.15 87.57,128.18 89.6,130.22 91.12,130.22 94.68,126.66 ; U19.1 41.08,124.76 v1(33.63,132.2) 33.63,132.21 H19.1 ; 126.52,126.15 126.52,126.41 128.81,128.69 136.05,128.69 U25.1 141.13,126.15 149.3,126.15 U26.1 ; 126.52,126.15 119.92,132.76 117.38,132.76 116.87,132.25 116.87,124.88 ; v1(115.59,93.74) 114.58,92.72 108.99,92.72 U30.1 107.46,93.74 105.33,93.74 ; 94.68,126.66 96.46,124.88 U21.1 ; 94.68,126.66 94.68,126.91 96.46,128.69 103.91,128.69 U22.1 108.89,126.05 113.41,126.05 114.58,124.88 116.87,124.88 ; 105.33,93.74 105.33,93.23 100.76,88.66 100.76,85.36 v1(91.87,76.47) ; v1(77.39,61.48) 79.42,63.51 79.42,64.28 78.66,65.04 78.66,65.55 80.19,67.07 87.81,67.07 v1(91.87,71.13) ; 116.87,124.88 U23.1 ; v1(127.28,94.5) 128.61,94.5 129.12,93.99 130.39,95.26 135.21,95.26 v1(135.97,96.03) 139.41,99.46 143.48,99.46 v1(144.1,100.09)
3V3: length 557.3
  Top Layer w0.254: 98.6,61.89 100.12,63.41 R18.2 100.95,63.09 v1(101.38,63.09) ; 98.6,61.89 98.49,61.89 R17.2 95.56,64.82 I2C1-A0.1 I2C1-A1.1 I2C1-A2.1 I2C1-PWR1.1 ; 98.6,61.89 v1(99.87,60.62) ; v1(109.65,78.52) R15.2 R16.2 R13.2 R14.2 R11.2 R12.2 R9.2 R10.2 ; v1(64.37,5.56) 64.07,5.26 U35.2 ; 49.47,94.78 R51.2 ; 49.47,94.78 50.85,96.16 U17.24 50.3,97.47 50.3,101.66 RN4.4 ; 49.47,94.78 50.74,93.51 v1(50.74,92.24) ; U48.4 16.78,85.14 16.02,85.9 16.02,88.69 U44.15 13.22,94.53 v1(13.22,95.04) ; 77.07,3.53 79.1,1.5 108.06,1.5 108.57,2.01 108.57,2.77 109.84,4.04 111.87,4.04 v1(112,4.16) ; 77.07,3.53 77.07,4.24 U36.2 ; 77.07,3.53 76.56,3.02 70.21,3.02 v1(68.94,4.29) ; v1(13.22,97.84) 12.97,98.09 v1(12.97,104.19) ; v1(127.54,25.45) 128.81,25.45 U39.16 129.88,25.4 134.28,21 CN59.2 142.89,21 ; v1(19.83,121.71) 19.83,117.9 v1(17.03,115.11) ; 28.46,125.01 34.56,125.01 v1(38.62,120.95) ; 28.46,125.01 28.46,126.28 27.45,127.3 26.18,127.3 25.67,127.81 25.67,131.57 H19.2 ; 28.46,125.01 U43.3 ; v1(112.06,49.69) 112.31,49.69 114.6,47.4 127.98,47.4 128.13,47.55 128.89,47.55 ; 128.89,47.55 CN11.1 CN12.1 CN10.1 ; 128.89,47.55 v1(128.89,46.28) ; RN4.4 51.58,102.94 v1(51.58,107.11) ; RN4.4 RN4.3 RN4.2 RN4.1 RN3.4 RN3.3 RN3.2 RN3.1 ; 142.89,21 CN56.2 ; 142.89,21 143.4,20.49 143.4,17.95 142.89,17.44 142.89,17.19 ; U49.3 U49.6 U49.9 U49.12 ; 102.66,78.52 R8.1 R5.1 R6.1 R3.1 R4.1 R1.1 R2.1 57.84,82.08 RN2.4 RN2.3 RN2.1 RN1.3 RN1.2 RN1.1 51.5,85.95 v1(51.5,86.4) ; 102.66,78.52 R7.1 v1(108.38,78.52) ; 102.66,78.52 101.9,77.76 101.9,71.67 102.65,70.92 102.65,66.86 102.9,66.61 U2.24 v1(102.9,63.85) ; 142.89,17.19 142.89,10.27 ; 142.89,17.19 140.6,14.9 v1(125.36,14.9)
  Bottom Layer w0.254: 51.58,113.46 52.34,112.69 52.34,107.87 v1(51.58,107.11) ; 51.58,113.46 I2CX-A1.1 I2CX-A0.1 ; 51.58,113.46 I2CX-A2.1 43.58,120.95 v1(38.62,120.95) ; v1(127.54,25.45) 128.89,26.8 v1(128.89,46.28) ; v1(12.97,104.19) 17.03,108.25 v1(17.03,115.11) ; 112.51,4.16 v1(112,4.16) ; 112.51,4.16 U50.12 ; 112.51,4.16 U50.9 U50.6 U50.3 120.19,17.95 120.28,17.95 ; v1(50.74,92.24) 50.74,87.16 v1(51.5,86.4) ; v1(102.9,63.85) 102.14,63.85 v1(101.38,63.09) ; v1(112.06,49.69) 111.81,49.44 111.81,47.4 104.54,47.4 99.87,52.07 v1(99.87,60.62) ; CN63.2 CN62.2 CN61.2 CN60.2 117.23,21 120.28,17.95 ; 120.28,17.95 123.33,14.9 v1(125.36,14.9) ; v1(13.22,97.84) v1(13.22,95.04) ; v1(68.94,4.29) 65.64,4.29 v1(64.37,5.56) ; v1(19.83,121.71) 21.61,123.49 U43.3 ; v1(108.38,78.52) v1(109.65,78.52)
GND: length 1264.8
  Top Layer w0.254: 89.53,108.31 PWM-A4.3 PWM-A5.3 ; 89.53,108.31 89.53,103.67 LED10.2 ; 89.53,108.31 PWM-A3.3 PWM-A2.3 PWM-A1.3 PWM-A0.3 99.95,107.55 ; 11.7,127.35 16.02,127.35 18.56,124.81 24.66,124.81 24.91,125.06 25.17,125.06 ; 11.7,127.35 11.34,127.35 8.4,124.41 8.4,118.21 9.16,117.44 v1(10.69,117.44) ; 11.7,127.35 11.7,128.57 ; v1(19.32,111.57) 16.78,111.57 16.27,112.08 15.76,112.08 ; 68.69,20.98 SONAR2.2 74.88,20.89 79.07,20.89 80.34,22.16 ; 68.69,20.98 SONAR1.2 SONAR0.2 ; 68.69,20.98 69.45,20.22 69.45,11.51 U35.9 ; 6.57,30.36 ETHERNET1.9 ; 6.57,30.36 6.57,30.61 11.4,35.44 USB1.5 13.43,38.74 13.43,40.79 ; 6.57,30.36 6.83,30.36 15.46,21.72 18.2,21.72 20.23,19.69 20.23,19.44 ETHERNET1.8 24.65,19.35 CR2032.2 ; 42.69,122.86 C1.2 40.15,120.32 37.53,120.32 35.58,122.27 26.44,122.27 25.17,123.54 25.17,125.06 ; 42.69,122.86 50.31,122.86 52.34,120.83 52.6,120.83 ; 42.69,122.86 42.69,132.19 3.3VEXT1.1 ; 111.29,109.08 101.47,109.08 99.95,107.55 ; 111.29,109.08 112.81,110.6 117.38,110.6 v1(117.64,110.34) 117.64,110.09 117.89,109.84 117.89,109.33 ; 111.29,109.08 v1(111.29,108.82) ; 52.6,120.83 52.64,120.83 C2.2 ; 52.6,120.83 54.88,123.12 ; 54.88,123.12 57.17,120.83 ; 54.88,123.12 v1(54.88,129.21) ; 57.17,120.83 58.69,119.31 58.69,112.45 58.44,112.19 ; 57.17,120.83 65.5,120.83 C3.2 73.11,120.7 CN72.1 76.83,116.98 80.9,116.98 ; 80.34,22.16 80.34,22.08 SONAR3.2 82.71,19.71 82.71,11.81 U36.9 ; 80.34,22.16 80.34,22.67 74.25,28.77 74.25,37.4 ; v1(16.13,83.98) 13.59,83.98 13.08,83.47 v1(13.08,77.88) ; v1(68.59,133.52) 70.43,135.36 77.73,135.36 LED2.2 79.76,135.36 88.44,135.36 LED1.2 90.47,135.36 99.15,135.36 LED3.2 101.18,135.36 109.86,135.36 LED4.2 111.89,135.36 120.57,135.36 LED5.2 122.6,135.36 131.28,135.36 LED6.2 133.31,135.36 141.99,135.36 LED7.2 144.02,135.36 152.7,135.36 LED8.2 ; v1(97.24,56.94) 101.05,56.94 102.07,55.93 107.15,55.93 110.05,58.83 U2.12 110.13,59.93 v1(110.13,62.45) ; 15.76,112.08 14.79,112.08 U46.5 ; 15.76,112.08 v1(15.76,112.58) ; 25.17,125.06 25.97,125.06 U43.2 ; 117.89,109.33 118.4,109.33 120.18,107.55 ; 117.89,109.33 117.21,108.65 U18.25 ; v1(122.06,74.02) I2C5.1 ; U17.12 61.36,87.51 75.58,87.51 76.85,86.24 85.06,86.24 CN81.1 87.6,86.24 95.84,86.24 97.12,87.51 ; v1(108.61,70.84) 108.86,71.09 I2C4.1 109,72.24 109,78.85 109.51,79.36 v1(121.96,79.36) 121.96,86.47 ; 74.25,37.4 64.75,37.4 ; 74.25,37.4 76.02,37.4 v1(76.28,37.15) ; U18.14 110.71,114.25 110.97,114.5 110.97,115.01 CN75.1 106.42,118.25 103.88,120.79 97.27,120.79 97.02,120.54 CN74.1 95.75,116.98 87.56,116.98 CN73.1 85.02,116.98 80.9,116.98 ; 80.9,116.98 80.9,110.73 PWM-A5.3 ; LED13.2 122.36,102.83 123.74,102.83 123.89,102.97 123.89,104.1 123.63,104.35 123.38,104.35 120.18,107.55 ; LED9.2 83.31,108.16 PWM-A5.3 ; 119.92,87.48 119.92,88.5 114.84,93.58 114.84,93.83 115.86,94.85 115.86,101.45 v1(112.3,105.01) ; 119.92,87.48 119.92,86.98 120.69,86.22 121.19,86.22 121.45,86.47 121.96,86.47 ; 119.92,87.48 118.55,87.48 CN84.1 117.26,86.24 109.05,86.24 CN83.1 106.51,86.24 99.15,86.24 97.88,87.51 97.12,87.51 ; 13.43,40.79 11.4,42.82 USB1.5 7.07,56.04 v1(5.84,56.04) ; 13.43,40.79 13.93,40.79 USB1.4 ; I2CX-A0.3 58.69,109.57 58.69,111.94 58.44,112.19 ; v1(19.69,88.3) 19.69,88.8 23.89,93.01 ; 120.18,107.55 120.94,108.31 130.38,108.31 134.6,104.09 134.6,103.59 ; 132.31,103.59 133.08,102.82 134.35,102.82 134.6,103.08 134.6,103.59 ; 134.6,103.59 135.62,104.6 142.01,104.6 LED15.2 144.05,104.6 152.73,104.6 LED16.2 ; 97.12,87.51 CN82.1 ; v1(19.07,107.76) C4.2 23.89,103.95 23.89,93.01 ; v1(112.66,15.41) 118.76,15.41 v1(121.3,17.95) 123.22,17.95 U39.7 U39.8 ; 23.89,93.01 U43.15 ; 121.96,86.47 123.22,86.47 123.48,86.22 127.96,86.22 CN85.1 130.53,86.24 138.7,86.24 CN86.1 141.24,86.24 149.43,86.24 CN87.1 ; 99.95,107.55 99.95,103.81 LED11.2 ; v1(143.4,23.53) CN58.1 v1(139.69,23.53) ; CN12.2 141.87,43.93 141.87,43.12 ; 58.44,112.19 57.17,112.19 54.38,109.4 54.38,108.46 I2CX-A1.3 I2CX-A2.3 ; 141.87,43.12 141.87,42.11 141.11,41.35 133.06,41.35 130.27,44.14 v1(130.27,44.9) U42.2 U6.2 v1(110.63,44.9) ; 141.87,43.12 152.76,43.12 CN10.2 ; v1(101.07,25.46) 100.82,25.46 v1(90.66,35.62) 88.88,37.4 v1(87.1,37.4) ; v1(58.08,73.88) v1(56.83,73.88) ; 112.3,105 LED12.2 ; v1(64.68,74.39) 65.7,73.38 v1(68.75,73.38) ; U50.10 108.44,3.66 v1(108.44,4.42)
  Bottom Layer w0.254: 139.58,6.91 140.09,6.4 140.59,6.4 141.61,7.42 141.61,8.18 140.85,8.94 139.32,8.94 137.8,10.47 ; 139.58,6.91 138.77,7.72 U49.4 ; 139.58,6.91 139.53,6.91 U49.7 U49.10 ; 17.65,83.72 18.53,82.85 U48.3 ; 17.65,83.72 17.4,83.98 v1(16.13,83.98) ; 17.65,83.72 19.69,85.75 v1(19.69,88.3) ; 155.01,23.53 CN57.1 v1(143.4,23.53) ; v1(19.32,111.57) 20.34,110.55 20.34,110.04 ; U1.64 22.5,112.21 20.34,110.04 ; 137.91,23.53 137.91,11.85 137.8,11.74 137.8,10.47 ; 137.91,23.53 CN59.1 135.63,42.99 CN11.2 133.43,44.9 v1(130.27,44.9) ; 137.91,23.53 v1(139.69,23.53) ; v1(110.63,44.9) 110.63,39.31 111.39,38.55 112.41,38.55 112.92,38.04 112.92,36.89 111.65,35.62 v1(90.66,35.62) ; v1(110.63,44.9) U6.2 ; v1(110.63,44.9) U5.2 97.24,52.19 v1(97.24,56.94) 95.47,56.94 I2C1-A0.3 I2C1-A1.3 I2C1-A2.3 ; 109.11,9.56 108.41,10.26 U50.1 ; 109.11,9.56 109.62,9.06 110.38,9.06 111.14,9.82 111.14,13.88 v1(112.66,15.41) ; 109.11,9.56 109.11,9.4 U50.4 U50.7 107.68,5.18 v1(108.44,4.42) ; CN79.1 149.26,116.98 141.1,116.98 CN78.1 138.56,116.98 130.4,116.98 CN77.1 128.05,117.17 118.94,117.17 118.43,117.68 ; 118.43,117.68 118.43,117.42 118.65,117.2 118.65,111.36 v1(117.64,110.34) ; 118.43,117.68 CN76.1 ; v1(19.07,107.76) 19.07,108.77 20.34,110.04 ; v1(15.76,112.58) 15.76,113.64 U46.4 11.19,114.65 10.43,115.41 10.43,117.19 v1(10.69,117.44) ; v1(87.1,37.4) 76.53,37.4 v1(76.28,37.15) ; 69.76,72.36 v1(68.75,73.38) ; 69.76,72.36 69.51,72.11 I2C1.1 ; 69.76,72.36 70.64,73.24 81.33,73.24 I2C2.1 82.96,72.11 84.23,70.84 90.58,70.84 91.85,72.11 I2C3.1 96.93,70.84 v1(108.61,70.84) 109.88,70.84 111.4,69.31 111.4,68.8 111.15,68.55 111.15,67.28 112.42,66.01 112.42,64.74 v1(110.13,62.45) ; v1(112.3,105.01) 111.29,106.03 v1(111.29,108.82) ; v1(68.59,133.52) CUSTOM1.1 66.25,131.18 56.33,131.18 5VEXT1.1 54.88,132.28 v1(54.88,129.21) ; I2C0.1 56.83,72.87 v1(56.83,73.88) ; CN63.1 98.51,25.46 v1(101.07,25.46) 101.07,25.41 CN62.1 CN61.1 CN60.1 v1(121.3,17.95) ; v1(64.68,74.39) 63.92,75.15 59.35,75.15 v1(58.08,73.88) ; 137.8,10.47 U49.1 ; I2C7.1 149.73,70.84 151.27,70.84 152.28,71.85 152.28,72.36 150.76,73.88 137.04,73.88 I2C6.1 133.35,74.02 v1(122.06,74.02) 122.06,75.04 121.96,75.15 v1(121.96,79.36) ; v1(5.84,56.04) H18.3 H18.1 2.29,62.89 10.41,71.02 10.41,73.06 11.43,74.07 12.19,74.07 13.08,74.96 v1(13.08,77.88)
VBAT: length 57.5
  Top Layer w0.254: U48.5 17.54,79.55 17.54,55.23 37.72,35.06
VIN: length 468.2
  Top Layer w0.343: 77.02,9.25 73.02,5.25 68.92,5.25 ; 77.02,9.25 80.92,5.35 U36.8 ; 77.02,9.25 U36.15 77.02,11.25 76.79,11.48 v1(76.79,19.98) ; 68.92,5.25 U35.8 ; 68.92,5.25 65.42,8.75 64.42,8.75 64.07,9.1 U35.15
  Top Layer w0.5: C2.1 52.55,124.25 52.55,129.45 ; 52.55,129.45 53.05,129.95 68.05,129.95 74.55,123.45 76.82,123.45 77.82,124.45 ; 52.55,129.45 52.55,129.95 48.55,133.95 37.32,133.95 36.32,132.95 31.32,132.95 U43.1 ; v1(89.62,91.76) 89.62,93.23 U28.3 ; 78.12,123.65 U19.3 77.82,124.45 ; 78.12,123.65 v1(78.12,122.76) ; 78.12,123.65 v1(78.32,123.45) ; 78.12,123.65 77.82,123.95 77.82,124.45 ; v1(115.62,69.26) 117.62,71.26 v1(117.62,75.76) ; v1(100.32,122.45) 93.82,122.45 v1(92.32,120.95) ; v1(118.76,123.39) 119.49,123.39 U23.3 120.98,123.88 v1(120.48,123.38)
  Bottom Layer w0.343: 76.79,23.48 v1(76.79,19.98)
  Bottom Layer w0.5: v1(117.62,75.76) 117.62,79.76 125.12,87.26 125.12,90.76 123.62,92.26 ; U21.3 100.32,124.11 100.32,122.95 ; 82.12,97.26 82.12,95.76 81.62,95.26 80.12,95.26 79.12,94.26 79.12,93.76 ; 82.12,97.26 82.12,98.26 81.85,98.53 81.85,119.03 v1(78.12,122.76) ; 82.12,97.26 83.12,98.26 91.62,98.26 92.7,97.18 92.7,95.18 93.12,94.76 95.12,94.76 95.62,95.26 98.12,95.26 99.12,94.26 ; v1(115.62,69.26) 113.62,67.26 113.62,36.76 111.77,34.9 U4.1 U8.1 U40.1 68.04,34.9 ; 99.12,94.26 100.12,95.26 102.62,95.26 103.12,94.76 106.12,94.76 106.62,95.26 109.12,95.26 110.12,94.26 ; 99.12,94.26 99.39,93.99 U29.3 ; 123.62,92.26 129.92,92.26 U32.3 133.16,92.49 140.86,92.49 U33.3 143.86,92.49 151.56,92.49 U34.3 ; 123.62,92.26 123.12,92.76 122.12,92.76 120.89,93.99 ; 68.04,34.9 U41.1 ; 68.04,34.9 68.04,23.59 ; SONAR3.1 SONAR2.1 SONAR1.1 68.04,23.59 ; 110.12,94.26 111.12,95.26 119.62,95.26 120.89,93.99 ; 110.12,94.26 110.26,94.12 U30.3 ; 120.89,93.99 U31.3 ; U26.3 151.11,122.88 144.4,122.88 U25.3 140.9,123.38 133.19,123.38 U24.3 131.48,124.88 129.98,123.38 125.98,123.38 124.48,121.88 121.98,121.88 v1(120.48,123.38) ; U27.3 78.4,93.76 79.12,93.76 ; 68.04,23.59 61.65,23.59 SONAR0.1 ; 110.26,124.39 U22.3 ; 110.26,124.39 111.26,123.39 v1(118.76,123.39) ; 110.26,124.39 109.15,123.28 100.65,123.28 100.32,122.95 ; 88.82,124.95 87.32,123.45 v1(78.32,123.45) ; 88.82,124.95 U20.3 ; 88.82,124.95 88.82,124.45 v1(92.32,120.95) ; v1(100.32,122.45) 100.32,122.95 ; 79.12,93.76 81.12,91.76 v1(89.62,91.76)
A0: length 137.7
  Top Layer w0.254: v1(125.49,17.83) 128.82,17.83 U39.10 ; v1(113.3,25.95) 99.84,39.42 v1(95.01,39.42) ; v1(43.96,77.52) 44.47,77.52 v1(72.15,49.83)
  Bottom Layer w0.254: v1(72.15,49.83) 78.4,43.58 90.85,43.58 v1(95.01,39.42) ; U43.13 43.96,81.07 v1(43.96,77.52) ; v1(125.49,17.83) 116.86,26.46 113.81,26.46 v1(113.3,25.95)
A1: length 147.8
  Top Layer w0.254: v1(129.88,19.63) 129.43,19.63 U39.11 ; U43.12 52.34,75.23 52.34,72.69 74.67,50.36 112.54,50.36 v1(114.82,48.07)
  Bottom Layer w0.254: v1(129.88,19.63) 129.11,20.39 129.11,23.37 128.29,24.2 127.78,24.2 126.76,25.21 126.76,36.39 119.65,43.5 118.89,43.5 114.82,47.57 v1(114.82,48.07)
A17: length 154.1
  Top Layer w0.254: v1(53.86,73.2) 57.02,73.2 57.17,73.05 57.17,71.93 78.25,50.85 115.59,50.85 v1(117.87,48.56) ; U43.16 27.19,90.47 v1(45.99,71.67) ; U39.9 129.41,17.06 v1(129.81,17.06)
  Bottom Layer w0.254: v1(45.99,71.67) 52.34,71.67 v1(53.86,73.2) ; v1(129.81,17.06) 130.57,17.83 130.57,19.86 129.56,20.87 129.56,46.53 127.52,48.56 v1(117.87,48.56)
ANALOG: length 123.4
  Top Layer w0.254: v1(67.83,47.04) 68.09,47.04 71.39,43.73 72.41,43.73 80.03,36.11 82.57,36.11 94,24.68 120.41,24.68 122.23,22.86 U39.3
  Bottom Layer w0.254: U43.17 v1(67.83,47.04)
ANALOG-EN: length 101
  Top Layer w0.254: v1(65.97,79.12) RN2.5 57.84,89.28 57.35,89.78 U17.11 ; v1(103.56,38.23) 103.31,37.98 103.31,36.96 114.23,26.04 115.5,26.04 v1(116.26,25.28) ; v1(67.24,77.85) 67.75,77.85 73.08,72.52 73.08,71.76 v1(79.43,65.41) ; v1(120.07,21.47) 122.48,19.05 U39.6
  Bottom Layer w0.254: v1(103.56,38.23) 103.31,38.48 103.31,40.52 84.25,59.57 84.25,60.58 v1(79.43,65.41) ; v1(116.26,25.28) v1(120.07,21.47) ; v1(65.97,79.12) v1(67.24,77.85)
BCLK2: length 197
  Bottom Layer w0.254: U49.2 140.34,24.82 139.46,25.7 139.46,51.35 116.6,74.21 73.68,74.21 50.31,97.58 47.01,97.58 27.45,117.14 19.83,117.14 18.56,115.87 U44.6
CRX1: length 160.2
  Bottom Layer w0.254: U43.4 27.7,120.95 73.93,74.72 116.86,74.72 149.03,42.55 CN10.3
CS: length 139.5
  Top Layer w0.254: v1(70.63,43.48) 70.37,43.48 v1(67.07,46.78) ; v1(94.76,25.47) 94.25,25.98 94.25,26.46 82.06,38.65 80.79,38.65 75.71,43.73 v1(73.42,43.73)
  Bottom Layer w0.254: U44.12 13.48,100.63 25.67,88.44 25.67,87.42 26.43,86.66 27.45,86.66 67.07,47.04 v1(67.07,46.78) ; v1(70.63,43.48) 70.88,43.73 v1(73.42,43.73) ; U50.2 109.74,10.48 109.24,10.48 100.09,19.63 96.28,19.63 94.76,21.15 v1(94.76,25.47)
CTX1: length 173.9
  Top Layer w0.254: v1(57.42,114.85) 53.86,118.41 U43.5 ; v1(113.81,80.06) 111.27,82.6 v1(89.17,82.6)
  Bottom Layer w0.254: v1(113.81,80.06) 113.81,78.53 119.14,73.2 122.95,73.2 123.21,72.94 123.21,71.67 151.15,43.73 155.07,43.73 155.83,42.97 155.83,41.19 CN10.4 ; v1(89.17,82.6) 88.92,82.34 84.09,82.34 79.52,86.91 79.52,87.93 73.68,93.77 73.68,107.23 66.06,114.85 v1(57.42,114.85)
CUST: length 303.4
  Top Layer w0.5: 101.96,124.76 101.66,124.76 100.16,123.26 95.16,123.26 93.66,124.76 91.16,124.76 ; 101.96,124.76 101.96,123.76 104.46,121.26 106.96,121.26 107.61,121.9 107.61,122.61 106.46,123.76 106.46,128.26 106.96,128.76 113.3,128.76 114.3,127.76 114.3,126.38 U22.5 112.8,122.88 v1(113.3,122.38) ; 101.96,124.76 U21.5 ; 144.94,116.88 v1(144.94,105.38) ; 144.94,116.88 128.02,116.88 125.52,119.38 125.52,122.38 ; 144.94,116.88 145.44,116.88 146.44,117.88 146.44,123.38 U25.5 148.94,128.88 156.15,128.88 157.15,127.88 157.15,126.38 U26.5 ; v1(118.3,121.38) 120.02,121.38 U23.5 125.02,123.38 125.02,122.88 125.52,122.38 ; 82.16,126.76 83.66,125.26 83.66,124.76 85.66,122.76 89.16,122.76 91.16,124.76 ; 82.16,126.76 82.16,127.76 80.9,129.02 v1(74.63,129.02) ; 82.16,126.76 82.16,126.26 U19.5 ; 91.16,124.76 91.29,124.88 U20.5 ; 102.49,94.38 102.49,93.99 v1(101.49,92.99) ; 102.49,94.38 v1(103.99,95.88) ; 102.49,94.38 U29.5 ; U24.5 131.73,122.38 125.52,122.38 ; C3.1 v1(65.63,126.52) ; v1(115.19,96.38) U30.5
  Bottom Layer w0.5: v1(74.63,129.02) 71.63,132.02 69.13,132.02 ; 123.94,97.88 117.94,97.88 116.44,96.38 v1(115.19,96.38) 113.69,97.88 105.99,97.88 v1(103.99,95.88) ; 123.94,97.88 124.94,96.88 124.94,95.44 U31.5 ; 123.94,97.88 123.94,100.38 128.94,105.38 142.94,105.38 144.94,103.38 ; 146.44,96.88 147.44,97.88 156.1,97.88 157.1,96.88 157.1,95.49 U34.5 ; 146.44,96.88 146.44,95.54 U33.5 ; 146.44,96.88 144.94,98.38 ; v1(113.3,122.38) 117.3,122.38 v1(118.3,121.38) ; 144.94,98.38 139.44,98.38 135.05,93.99 U32.5 ; 144.94,98.38 144.94,103.38 ; 69.13,132.02 69.63,132.52 69.63,133.52 68.63,134.52 64.59,134.52 CUSTOM1.2 ; 69.13,132.02 65.63,128.52 v1(65.63,126.52) ; v1(101.49,92.99) 100.99,92.49 92.9,92.49 U28.5 89.9,92.49 82.2,92.49 U27.5 ; v1(144.94,105.38) 144.94,103.38
ECHO0: length 102.2
  Top Layer w0.254: v1(14.75,56.94) 14.75,55.16 34.81,35.1 34.81,30.78 63.08,2.51 66.3,2.51 67.32,3.53 U35.7 ; v1(9.16,62.53) 8.4,63.29 8.4,71.93 U44.22
  Bottom Layer w0.254: v1(9.16,62.53) v1(14.75,56.94)
ECHO1: length 88.8
  Top Layer w0.254: v1(66.02,7.2) U35.5 ; v1(16.27,58.72) 16.27,65.58 U44.24
  Bottom Layer w0.254: v1(66.02,7.2) 66.02,9.74 17.03,58.72 v1(16.27,58.72)
ECHO2: length 94.4
  Top Layer w0.254: v1(73.68,21.64) 73.68,23.92 63.52,34.08 63.52,36.11 U43.23 ; U36.7 80.27,3.36 80.53,3.09 81.3,3.09 81.55,3.35 81.55,7.41 v1(80.28,8.68)
  Bottom Layer w0.254: v1(80.28,8.68) 73.68,15.29 v1(73.68,21.64)
ECHO3: length 97.5
  Top Layer w0.254: v1(78.97,6.18) 78.97,4.29 ; U43.21 63.52,41.19 63.52,36.88 64.28,36.11 65.55,36.11 78.76,22.91 v1(78.76,21.64)
  Bottom Layer w0.254: v1(78.76,21.64) 80.24,20.15 80.24,12.28 81,11.51 81,8.21 v1(78.97,6.18)
I2C1-RESET: length 73.7
  Top Layer w0.254: U2.3 104.2,58.71 103.56,58.06 95.43,58.06 95.17,58.32 84.51,58.32 v1(78.69,64.14) ; v1(64.21,73.79) 72.08,65.92 v1(73.35,65.92) ; v1(60.91,74.55) 60.65,74.55 50.24,84.97 50.24,86.49 RN1.8 51,87.51 52.78,89.28 52.78,90.86 U17.4
  Bottom Layer w0.254: v1(78.69,64.14) 76.65,66.17 73.6,66.17 v1(73.35,65.92) ; v1(64.21,73.79) 63.44,74.55 v1(60.91,74.55)
I2C2-RESET: length 4.3
  Top Layer w0.254: RN1.7 51.8,87.51 53.45,89.15 U17.5
IN1: length 115.8
  Top Layer w0.254: U43.19 63.52,46.27 63.52,44.5 64.28,43.73 65.04,43.73 70.12,38.65 75.71,38.65 95.27,19.1 95.27,18.08 104.41,8.94 108.75,8.94 U50.5
IN2: length 52.3
  Top Layer w0.254: U17.1 48.96,92.76 R51.1 45.67,96.57 v1(45.48,96.57) ; U44.7 16.78,113.33 20.08,116.63 21.35,116.63 v1(21.61,116.38)
  Bottom Layer w0.254: v1(45.48,96.57) 27.45,114.6 26.43,114.6 25.67,115.36 25.67,116.38 25.42,116.63 21.86,116.63 v1(21.61,116.38)
LRCLK2: length 151.3
  Top Layer w0.254: v1(44.72,100.88) 44.72,90.98 49.8,85.9 49.8,84.63 59.96,74.47 59.96,71.67 80.03,51.61 v1(81.3,51.61) ; v1(117.11,39.42) 115.33,41.19 101.11,41.19 v1(100.85,40.94)
  Bottom Layer w0.254: v1(117.11,39.42) 117.11,39.39 U42.5 ; v1(44.72,100.88) 44.72,102.41 27.45,119.68 25.67,119.68 24.4,118.41 U44.5 ; v1(100.85,40.94) 94.5,40.94 89.17,46.27 86.63,46.27 v1(81.3,51.61)
MISO: length 103.7
  Bottom Layer w0.254: U44.14 12.97,94.28 17.54,94.28 22.88,88.95 22.88,86.41 25.16,84.12 27.7,84.12 63.52,48.31 63.52,47.04 64.53,46.02 72.66,46.02 74.18,44.5 74.18,41.96 74.69,41.45 80.66,41.45 81.61,42.4 88.88,42.4
MISO1: length 66.4
  Top Layer w0.254: v1(59.45,51.35) 59.45,52.88 U43.18 ; v1(59.96,48.81) 59.96,47.19 64.75,42.4 65.51,42.4 v1(66.02,41.89)
  Bottom Layer w0.254: v1(59.96,48.81) 59.45,49.32 v1(59.45,51.35) ; v1(66.02,41.89) 71.53,41.89 72.04,42.4
MOSI: length 107
  Top Layer w0.254: v1(82.88,39.65) 82.63,39.9 U8.3 81.59,39.92 80.28,39.92 74.18,46.02 71.14,46.02 69.36,47.8 67.07,47.8 65.55,46.27 64.28,46.27 62.75,47.8 v1(62.75,48.05) ; v1(22.62,81.07) 22.62,81.58 23.13,82.09 23.13,83.61 v1(20.34,86.41) ; v1(16.53,93.52) 11.95,98.09 U44.13
  Bottom Layer w0.254: v1(82.88,39.65) 88.63,39.65 U4.3 ; v1(16.53,93.52) 20.34,89.71 v1(20.34,86.41) ; v1(62.75,48.05) 58.44,48.05 27.45,79.04 24.65,79.04 v1(22.62,81.07)
MOSI1: length 81.4
  Top Layer w0.254: v1(60.21,45.51) 60.21,45.26 64.75,40.72 U41.3 v1(67.8,39.9)
  Bottom Layer w0.254: v1(67.8,39.9) U40.3 ; U44.18 13.48,85.39 15.51,83.36 15.51,80.56 24.65,71.42 34.31,71.42 v1(60.21,45.51)
ON_OFF: length 37.9
  Top Layer w0.254: U48.1 24.4,82.72 23.37,81.69 23.37,67.72 v1(21.08,65.44)
  Bottom Layer w0.254: v1(21.08,65.44) 9.14,65.44 H18.4
OUT1C: length 125.7
  Top Layer w0.254: v1(59.2,73.2) 59.2,73.71 58.18,74.72 54.37,74.72 v1(53.61,73.96) ; v1(86.63,45.51) 88.41,43.73 93.23,43.73 v1(94,42.97)
  Bottom Layer w0.254: v1(53.61,73.96) 53.1,73.45 43.2,73.45 27.45,89.2 25.67,89.2 U44.11 ; v1(94,42.97) 95.27,41.7 101,41.7 102.78,39.92 102.78,38.15 103.52,37.4 U5.5 ; v1(59.2,73.2) 64.28,73.2 67.07,70.4 67.07,64.82 86.38,45.51 v1(86.63,45.51)
OUT1D: length 179.9
  Top Layer w0.254: v1(70.37,50.34) 70.12,50.34 43.2,77.26 43.2,78.53 27.45,94.28 26.43,94.28 25.16,95.55 25.16,106.47 20.84,110.79 U44.8 ; v1(80.03,44.24) 80.53,43.73 82.57,43.73 87.65,38.65 89.17,38.65 102.63,25.19 113.81,25.19 v1(114.06,25.45)
  Bottom Layer w0.254: v1(80.03,44.24) 78.76,44.24 72.41,50.59 70.63,50.59 v1(70.37,50.34) ; U49.5 139.41,7.72 138.19,8.94 132.6,8.94 124.73,16.81 124.73,17.83 116.6,25.95 114.57,25.95 v1(114.06,25.45)
OUT2: length 139.3
  Top Layer w0.254: v1(74.95,75.48) 75.45,74.98 75.45,71.72 v1(81.55,65.63)
  Bottom Layer w0.254: v1(74.95,75.48) 73.93,75.48 51.07,98.34 51.07,98.6 27.45,122.22 26.18,122.22 24.91,120.95 U44.4 ; v1(81.55,65.63) 84.83,62.35 84.83,59.81 103.65,40.99 108.22,40.99 U6.5
PROGRAM: length 34.5
  Top Layer w0.254: U48.2 21.08,82.07 v1(21.08,70.01)
  Bottom Layer w0.254: H18.2 10.16,68.99 12.19,68.99 13.21,70.01 13.21,70.52 13.97,71.28 19.81,71.28 v1(21.08,70.01)
PWM-OE: length 74.5
  Top Layer w0.254: v1(115.66,105.43) 115.66,105.94 115.91,106.19 U18.23 ; RN1.6 52.57,87.28 52.57,87.57 54.1,89.1 U17.6 54.1,91.88 54.44,92.22 64.6,92.22 74.25,101.88 82.89,101.88 85.43,104.42 87.97,104.42 v1(88.48,103.91)
  Bottom Layer w0.254: v1(88.48,103.91) 88.99,104.42 114.64,104.42 v1(115.66,105.43)
RX1: length 143.5
  Top Layer w0.254: v1(67.33,76.75) 70.63,73.45 70.63,71.17 74.18,67.61 74.18,64.05 74.69,63.55 76.22,63.55 82.06,57.7 v1(90.44,57.7) ; U44.2 16.53,126.03 25.67,116.89 25.67,115.36 26.43,114.6 27.45,114.6 36.34,105.71 v1(36.34,100.38) ; U6.3 111.75,42.46 v1(110,42.46)
  Bottom Layer w0.254: v1(36.34,100.38) 43.7,93.01 50.82,93.01 54.63,89.2 56.91,89.2 65.29,80.82 65.29,78.79 v1(67.33,76.75) ; v1(110,42.46) 108.73,43.73 104.16,43.73 90.44,57.45 v1(90.44,57.7)
RX2: length 192.6
  Top Layer w0.254: v1(52.59,45.51) 63.01,35.1 63.01,33.57 v1(72.15,24.43) ; v1(11.19,84.12) 10.43,84.88 10.43,106.98 U44.9
  Bottom Layer w0.254: v1(72.15,24.43) 72.41,24.68 83.84,24.68 107.15,1.37 138.14,1.37 139.15,2.39 139.15,3.99 U49.8 ; v1(52.59,45.51) 49.8,45.51 12.97,82.34 12.97,83.36 12.21,84.12 v1(11.19,84.12)
RX5: length 129.8
  Top Layer w0.254: U42.3 117.82,43.67 100.66,43.67 v1(99.9,42.91)
  Bottom Layer w0.254: U43.6 27.19,115.87 49.04,94.03 53.1,94.03 68.09,79.04 68.09,68.37 75.45,61.01 76.98,61.01 95.52,42.46 99.45,42.46 v1(99.9,42.91)
RX7: length 109.7
  Top Layer w0.254: v1(91.46,41.96) 104.09,41.96 U5.3
  Bottom Layer w0.254: v1(91.46,41.96) 90.54,41.04 50.97,41.04 U44.20
SCK: length 83.1
  Top Layer w0.254: U43.14 27.45,95.55 74.18,48.81 76.98,48.81 v1(77.23,49.07)
  Bottom Layer w0.254: U4.5 U8.5 77.45,49.07 v1(77.23,49.07)
SCK1: length 76.1
  Bottom Layer w0.254: U40.5 U41.5 49.65,44.9 U44.19
SCL: length 172.7
  Top Layer w0.254: v1(117.48,105.56) 117.86,105.94 117.86,106.96 ; 90.85,66.95 v1(91.35,67.46) ; 90.85,66.95 91.61,66.19 94.91,66.19 97.69,63.41 R17.1 ; 90.85,66.95 86.27,71.52 86.27,72.54 80.94,77.87 v1(79.16,77.87) ; v1(64.18,92.86) 63.67,93.37 v1(52.75,93.37) 52.75,94.89 52.24,95.4 52.24,96.83 52.15,96.92 ; v1(104.56,93.37) 104.56,94.64 106.59,96.67 106.59,97.18 109.39,99.97 v1(110.66,99.97) ; v1(103.29,68.47) 104.2,67.57 U2.22
  Bottom Layer w0.254: v1(117.48,105.56) 117.99,106.07 119.89,106.07 121.42,104.54 121.42,103.78 119.64,102 112.69,102 v1(110.66,99.97) ; v1(91.35,67.46) 92.37,68.47 v1(103.29,68.47) ; v1(52.75,93.37) 52.49,93.62 44.11,93.62 U43.8 ; v1(104.56,93.37) 102.53,91.33 100.24,91.33 99.99,91.08 98.49,91.08 85.28,77.87 v1(79.16,77.87) v1(64.18,92.86)
SCL1: length 137.6
  Top Layer w0.254: U50.8 108.73,6.42 105.17,6.42 v1(74.95,36.64) ; v1(44.47,74.21) v1(69.36,49.32) ; v1(74.95,42.21) v1(76.72,40.43)
  Bottom Layer w0.254: v1(74.95,36.64) 76.72,38.42 v1(76.72,40.43) ; v1(69.36,49.32) 70.12,48.56 72.66,48.56 74.95,46.27 v1(74.95,42.21) ; U43.11 44.72,85.39 44.72,74.47 v1(44.47,74.21)
SCL2: length 152.5
  Top Layer w0.254: CN12.3 CN11.3 130.61,45.51 127.78,45.51 127.27,46.02 110,46.02 107.46,48.56 80.03,48.56 79.77,48.31 73.68,48.31 72.91,49.07 70.63,49.07 27.96,91.74 26.43,91.74 22.37,87.68 v1(19.07,87.68)
  Bottom Layer w0.254: U44.16 16.27,90.47 v1(19.07,87.68)
SDA: length 177
  Top Layer w0.254: U2.23 103.55,66.92 v1(103.31,67.16) ; U18.27 118.51,105.69 v1(118.3,105.47) ; v1(51.75,98.52) 51.5,98.26 U17.23 ; v1(99.72,61.9) R18.1 ; U43.9 35.58,99.61 42.43,99.61 44.97,102.15 v1(48.53,102.15) ; v1(80.71,75.4) 80.71,70.58 85.28,66 v1(85.28,65.5) ; v1(107.63,99.12) 106.11,97.6 106.11,96.84 103.82,94.55 103.82,93.28 v1(101.28,90.74)
  Bottom Layer w0.254: v1(48.53,102.15) 48.53,101.74 v1(51.75,98.52) 74.1,76.17 75.12,76.17 76.13,75.15 80.45,75.15 v1(80.71,75.4) 87.31,75.4 98.49,86.58 98.49,87.95 v1(101.28,90.74) ; v1(107.63,99.12) 108.39,99.12 113.22,103.95 116.78,103.95 v1(118.3,105.47) ; v1(103.31,67.16) 103.06,66.9 101.79,66.9 100.85,65.96 85.49,65.96 85.28,65.75 v1(85.28,65.5) 85.28,61.94 86.29,60.92 98.74,60.92 v1(99.72,61.9)
SDA1: length 141
  Top Layer w0.254: v1(74.44,49.58) 74.44,49.83 27.45,96.82 26.43,96.82 25.67,97.58 25.67,104.44 U43.10 ; v1(79.01,45) 79.01,43.23 81.04,41.19 82.31,41.19 87.65,35.86 87.65,34.08 v1(94.25,27.48)
  Bottom Layer w0.254: v1(94.25,27.48) 94,27.22 94,17.06 107.2,3.86 107.97,3.86 109.18,2.64 U50.11 ; v1(74.44,49.58) v1(79.01,45)
SDA2: length 150.6
  Top Layer w0.254: v1(17.29,86.41) 19.32,86.41 20.08,87.17 25.16,87.17 25.67,86.66 29.99,86.66 68.09,48.56 72.66,48.56 75.2,46.02 83.33,46.02 88.15,41.19 99.33,41.19 100.35,40.18 102.63,40.18 104.03,38.78 132.3,38.78 CN11.4 CN12.4
  Bottom Layer w0.254: v1(17.29,86.41) 15.76,87.93 U44.17
SPI0-SEL: length 55.7
  Top Layer w0.254: v1(54.41,86.24) 53.4,87.25 54.75,88.6 U17.7
  Bottom Layer w0.254: 81.61,47.4 57.46,71.55 57.46,83.19 v1(54.41,86.24)
SPI1-SEL: length 58.8
  Top Layer w0.254: v1(55.69,86.49) 55.44,86.74 RN2.8 55.44,90.83 U17.8
  Bottom Layer w0.254: v1(55.69,86.49) 67.63,74.55 67.63,66.17 86.4,47.4 88.88,47.4
SPI2-SEL: length 51.1
  Top Layer w0.254: U17.9 55.98,90.81 55.98,90.05 56.24,89.79 v1(56.24,88.01) 56.24,87.25 ; v1(65.13,50.68) 65.13,47.78 64.75,47.4
  Bottom Layer w0.254: v1(65.13,50.68) 65.38,50.93 65.38,53.72 54.97,64.14 54.97,84.71 53.7,85.98 53.7,86.49 55.22,88.01 v1(56.24,88.01)
SPI3-SEL: length 60.4
  Top Layer w0.254: RN2.6 56.95,87.16 ; 56.95,87.16 56.95,86.66 v1(56.78,86.49) 56.78,87 56.95,87.16 ; 56.95,87.16 56.95,88.36 56.7,88.61 U17.10 ; v1(64.66,52.96) v1(68.47,49.15)
  Bottom Layer w0.254: v1(68.47,49.15) 70.22,47.4 72.04,47.4 ; v1(56.78,86.49) 57.04,86.74 57.04,88.27 56.53,88.78 55.26,88.78 53.23,86.74 53.23,85.73 54.5,84.46 54.5,63.12 v1(64.66,52.96)
TRIG0: length 95.3
  Top Layer w0.254: U35.6 66.67,3.56 66.13,3.02 63.33,3.02 35.32,31.03 35.32,36.62 17.03,54.91 17.03,66.34 13.22,70.15 13.22,71.17 U44.23
TRIG1: length 81.8
  Top Layer w0.254: U35.4 65.37,6.58 60.21,11.73 60.21,36.88 U43.24
TRIG2: length 97.1
  Top Layer w0.254: v1(79.62,5.56) U36.6 ; v1(59.45,22.18) 59.71,22.43 59.71,35.61 25.67,69.64 25.67,73.96 U43.22
  Bottom Layer w0.254: v1(79.62,5.56) 78.96,4.9 76.72,4.9 61.99,19.64 61.23,19.64 60.21,20.65 60.21,21.41 v1(59.45,22.18)
TRIG3: length 100.3
  Top Layer w0.254: v1(76.98,5.63) 77.74,5.63 78.25,5.13 78.25,4.37 U36.4 ; v1(58.94,23.67) 58.94,35.61 25.16,69.39 25.16,78.53 U43.20
  Bottom Layer w0.254: v1(76.98,5.63) 76.72,5.63 67.07,15.29 67.07,17.06 61.99,22.14 60.47,22.14 v1(58.94,23.67)
TX1: length 149.9
  Top Layer w0.254: v1(101.36,67.86) 100.85,67.86 97.04,71.67 97.04,72.69 91.96,77.77 v1(88.66,77.77)
  Bottom Layer w0.254: U6.4 113.05,41.14 113.05,49.58 107.97,54.66 107.97,63.55 103.65,67.86 v1(101.36,67.86) ; v1(88.66,77.77) 88.15,77.26 74.44,77.26 50.56,101.14 50.56,101.9 27.7,124.76 12.97,124.76 U44.3
TX2: length 197.4
  Top Layer w0.254: v1(59.45,21.13) 51.07,29.51 v1(51.07,41.96)
  Bottom Layer w0.254: U49.11 138.56,0.86 79.97,0.86 68.85,11.98 67.07,11.98 61.99,17.06 61.23,17.06 59.45,18.84 v1(59.45,21.13) ; v1(51.07,41.96) 51.07,42.72 12.21,81.58 11.19,81.58 10.43,82.34 10.43,104.44 U44.10
TX5: length 133.9
  Top Layer w0.254: U43.7 25.67,112.06 25.67,107.74 26.43,106.98 27.45,106.98 49.29,85.14 49.29,79.04 52.85,75.48 52.85,73.2 74.95,51.1 v1(76.22,51.1) ; v1(79.01,49.07) 112.28,49.07 v1(114.57,46.78)
  Bottom Layer w0.254: v1(79.01,49.07) 76.98,51.1 v1(76.22,51.1) ; v1(114.57,46.78) 114.57,44.43 U42.4
TX7: length 116.2
  Top Layer w0.254: v1(16.78,70.66) 16.78,72.69 U44.21
  Bottom Layer w0.254: U5.4 105.68,38.76 105.68,36.98 104.99,36.3 89.35,36.3 89.09,36.04 51.4,36.04 v1(16.78,70.66)
$1N1577: length 88.7
  Top Layer w0.254: v1(18.47,85.41) 20.5,83.37 20.5,81.09 v1(19.74,80.33) ; v1(18.72,56.2) 18.98,56.45 v1(18.98,78.04) ; v1(17.96,97.85) v1(17.96,87.18)
  Bottom Layer w0.254: v1(18.47,85.41) 17.96,85.91 v1(17.96,87.18) ; v1(18.72,56.2) 18.47,56.2 17.78,55.51 ETHERNET1.1 ; v1(17.96,97.85) 17.96,111.06 U1.63 ; v1(18.98,78.04) 19.74,78.8 v1(19.74,80.33)
